# EAGLE design LED_chaser (EAGLE 9.4.2)

## Sheet 1 of 3
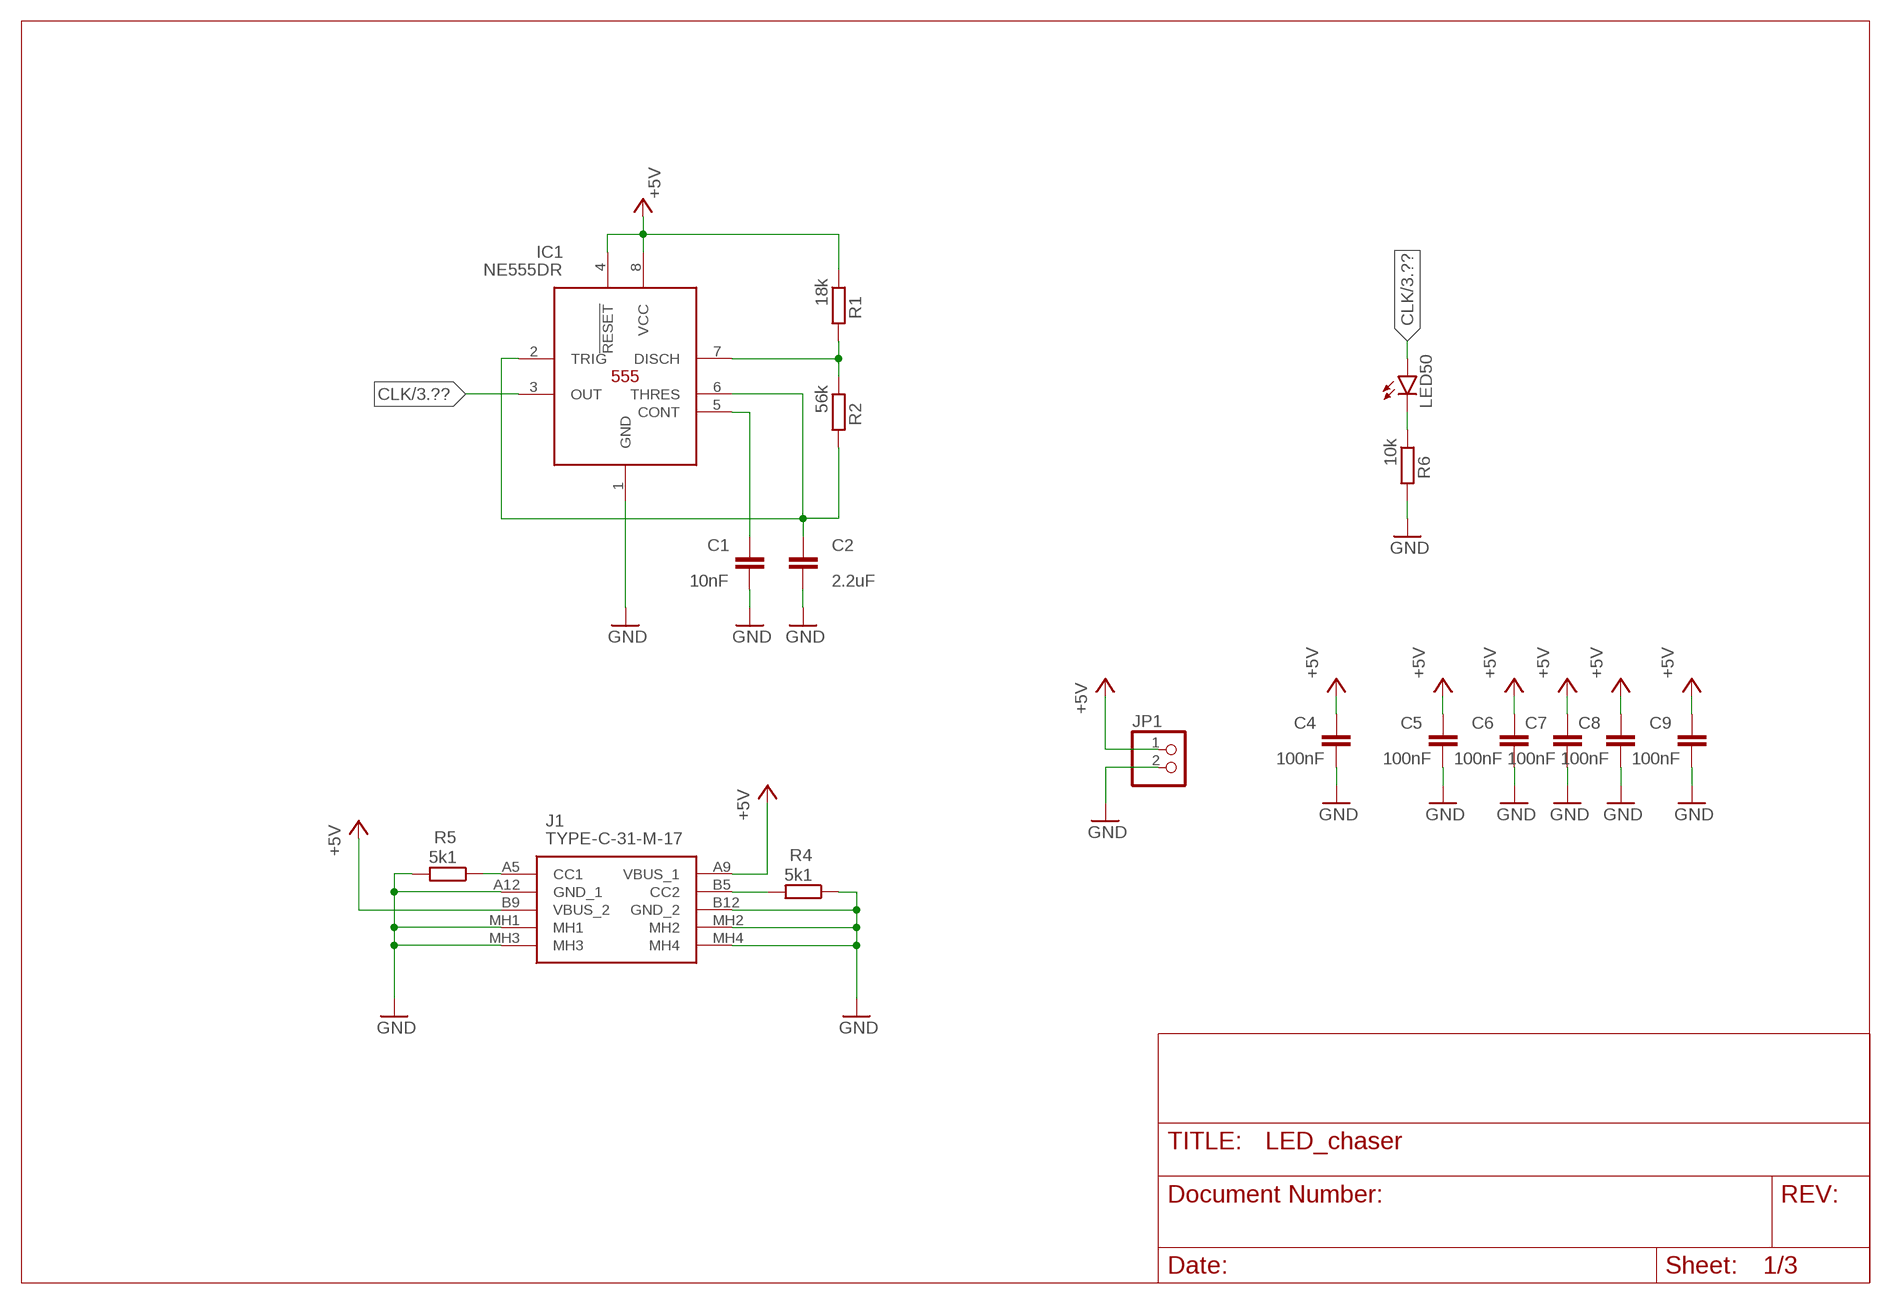
[diagram p0: schematic, sheet 1]

### Parts
C1  10nF  C-EUC0603  [C0603]
C2  2.2uF  C-EUC0603  [C0603]
C4  100nF  C-EUC0603  [C0603]
C5  100nF  C-EUC0603  [C0603]
C6  100nF  C-EUC0603  [C0603]
C7  100nF  C-EUC0603  [C0603]
C8  100nF  C-EUC0603  [C0603]
C9  100nF  C-EUC0603  [C0603]
IC1  NE555DR  [SOIC127P600X175-8N]
J1  TYPE-C-31-M-17  [TYPEC31M17]
JP1  PINHD-1X2  [1X02]
LED50  LEDCHIP-LED0603  [CHIP-LED0603]
R1  18k  R-EU_R0603  [R0603]
R2  56k  R-EU_R0603  [R0603]
R4  5k1  R-EU_R0603  [R0603]
R5  5k1  R-EU_R0603  [R0603]
R6  10k  R-EU_R0603  [R0603]

### Nets
+5V: C4.1 C5.1 C6.1 C7.1 C8.1 C9.1 IC1.4(!RESET) IC1.8(VCC) J1.A9(VBUS_1) J1.B9(VBUS_2) JP1.1 R1.1 ; also sheet 3
CLK: IC1.3(OUT) LED50.A ; also sheet 3
GND: C1.2 C2.2 C4.2 C5.2 C6.2 C7.2 C8.2 C9.2 IC1.1(GND) J1.A12(GND_1) J1.B12(GND_2) J1.MH1 J1.MH2 J1.MH3 J1.MH4 JP1.2 R4.1 R5.2 R6.2 ; also sheet 2,3
N$2: LED50.C R6.1
N$3: IC1.7(DISCH) R1.2 R2.1
N$5: C1.1 IC1.5(CONT)
N$8: C2.1 IC1.2(TRIG) IC1.6(THRES) R2.2
N$46: J1.A5(CC1) R5.1
N$47: J1.B5(CC2) R4.2

## Sheet 2 of 3
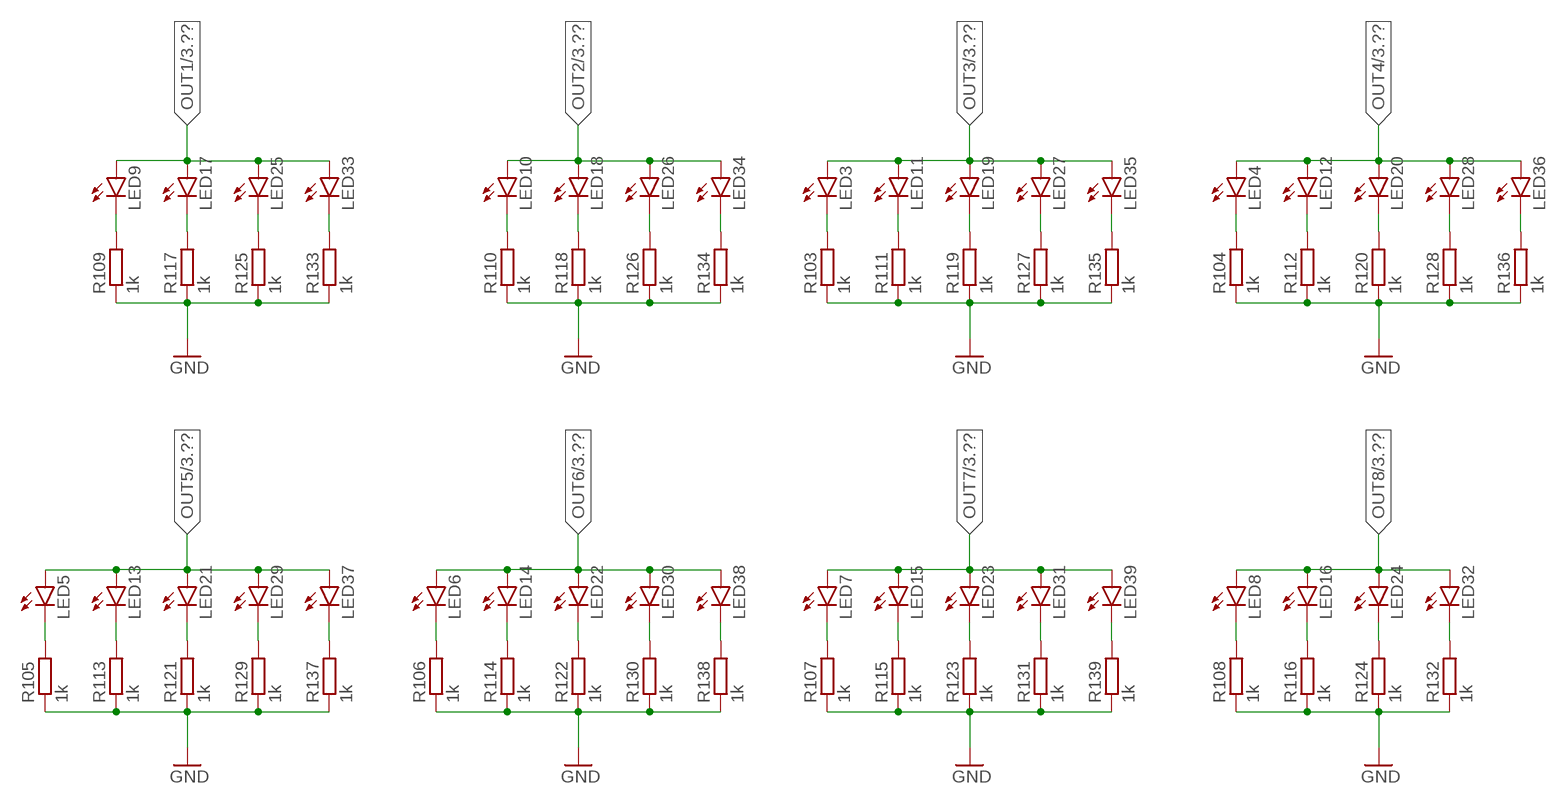
[diagram p1: schematic, sheet 2]

### Parts
LED3  LEDCHIPLED_1206  [CHIPLED_1206]
LED4  LEDCHIPLED_1206  [CHIPLED_1206]
LED5  LEDCHIPLED_1206  [CHIPLED_1206]
LED6  LEDCHIPLED_1206  [CHIPLED_1206]
LED7  LEDCHIPLED_1206  [CHIPLED_1206]
LED8  LEDCHIPLED_1206  [CHIPLED_1206]
LED9  LEDCHIPLED_1206  [CHIPLED_1206]
LED10  LEDCHIPLED_1206  [CHIPLED_1206]
LED11  LEDCHIPLED_1206  [CHIPLED_1206]
LED12  LEDCHIPLED_1206  [CHIPLED_1206]
LED13  LEDCHIPLED_1206  [CHIPLED_1206]
LED14  LEDCHIPLED_1206  [CHIPLED_1206]
LED15  LEDCHIPLED_1206  [CHIPLED_1206]
LED16  LEDCHIPLED_1206  [CHIPLED_1206]
LED17  LEDCHIPLED_1206  [CHIPLED_1206]
LED18  LEDCHIPLED_1206  [CHIPLED_1206]
LED19  LEDCHIPLED_1206  [CHIPLED_1206]
LED20  LEDCHIPLED_1206  [CHIPLED_1206]
LED21  LEDCHIPLED_1206  [CHIPLED_1206]
LED22  LEDCHIPLED_1206  [CHIPLED_1206]
LED23  LEDCHIPLED_1206  [CHIPLED_1206]
LED24  LEDCHIPLED_1206  [CHIPLED_1206]
LED25  LEDCHIPLED_1206  [CHIPLED_1206]
LED26  LEDCHIPLED_1206  [CHIPLED_1206]
LED27  LEDCHIPLED_1206  [CHIPLED_1206]
LED28  LEDCHIPLED_1206  [CHIPLED_1206]
LED29  LEDCHIPLED_1206  [CHIPLED_1206]
LED30  LEDCHIPLED_1206  [CHIPLED_1206]
LED31  LEDCHIPLED_1206  [CHIPLED_1206]
LED32  LEDCHIPLED_1206  [CHIPLED_1206]
LED33  LEDCHIPLED_1206  [CHIPLED_1206]
LED34  LEDCHIPLED_1206  [CHIPLED_1206]
LED35  LEDCHIPLED_1206  [CHIPLED_1206]
LED36  LEDCHIPLED_1206  [CHIPLED_1206]
LED37  LEDCHIPLED_1206  [CHIPLED_1206]
LED38  LEDCHIPLED_1206  [CHIPLED_1206]
LED39  LEDCHIPLED_1206  [CHIPLED_1206]
R103  1k  R-EU_R0603  [R0603]
R104  1k  R-EU_R0603  [R0603]
R105  1k  R-EU_R0603  [R0603]
R106  1k  R-EU_R0603  [R0603]
R107  1k  R-EU_R0603  [R0603]
R108  1k  R-EU_R0603  [R0603]
R109  1k  R-EU_R0603  [R0603]
R110  1k  R-EU_R0603  [R0603]
R111  1k  R-EU_R0603  [R0603]
R112  1k  R-EU_R0603  [R0603]
R113  1k  R-EU_R0603  [R0603]
R114  1k  R-EU_R0603  [R0603]
R115  1k  R-EU_R0603  [R0603]
R116  1k  R-EU_R0603  [R0603]
R117  1k  R-EU_R0603  [R0603]
R118  1k  R-EU_R0603  [R0603]
R119  1k  R-EU_R0603  [R0603]
R120  1k  R-EU_R0603  [R0603]
R121  1k  R-EU_R0603  [R0603]
R122  1k  R-EU_R0603  [R0603]
R123  1k  R-EU_R0603  [R0603]
R124  1k  R-EU_R0603  [R0603]
R125  1k  R-EU_R0603  [R0603]
R126  1k  R-EU_R0603  [R0603]
R127  1k  R-EU_R0603  [R0603]
R128  1k  R-EU_R0603  [R0603]
R129  1k  R-EU_R0603  [R0603]
R130  1k  R-EU_R0603  [R0603]
R131  1k  R-EU_R0603  [R0603]
R132  1k  R-EU_R0603  [R0603]
R133  1k  R-EU_R0603  [R0603]
R134  1k  R-EU_R0603  [R0603]
R135  1k  R-EU_R0603  [R0603]
R136  1k  R-EU_R0603  [R0603]
R137  1k  R-EU_R0603  [R0603]
R138  1k  R-EU_R0603  [R0603]
R139  1k  R-EU_R0603  [R0603]

### Nets
GND: R103.1 R104.1 R105.1 R106.1 R107.1 R108.1 R109.1 R110.1 R111.1 R112.1 R113.1 R114.1 R115.1 R116.1 R117.1 R118.1 R119.1 R120.1 R121.1 R122.1 R123.1 R124.1 R125.1 R126.1 R127.1 R128.1 R129.1 R130.1 R131.1 R132.1 R133.1 R134.1 R135.1 R136.1 R137.1 R138.1 R139.1 ; also sheet 1,3
N$4: LED9.C R109.2
N$7: LED17.C R117.2
N$9: LED25.C R125.2
N$11: LED33.C R133.2
N$13: LED6.C R106.2
N$16: LED14.C R114.2
N$17: LED22.C R122.2
N$18: LED30.C R130.2
N$21: LED38.C R138.2
N$22: LED7.C R107.2
N$23: LED15.C R115.2
N$24: LED23.C R123.2
N$25: LED31.C R131.2
N$26: LED39.C R139.2
N$27: LED5.C R105.2
N$28: LED13.C R113.2
N$29: LED21.C R121.2
N$30: LED29.C R129.2
N$31: LED37.C R137.2
N$32: LED8.C R108.2
N$33: LED16.C R116.2
N$34: LED24.C R124.2
N$35: LED32.C R132.2
N$38: LED10.C R110.2
N$39: LED18.C R118.2
N$40: LED26.C R126.2
N$41: LED34.C R134.2
N$42: LED3.C R103.2
N$43: LED11.C R111.2
N$44: LED19.C R119.2
N$45: LED27.C R127.2
N$51: LED35.C R135.2
N$52: LED4.C R104.2
N$53: LED12.C R112.2
N$54: LED20.C R120.2
N$55: LED28.C R128.2
N$56: LED36.C R136.2
OUT1: LED9.A LED17.A LED25.A LED33.A ; also sheet 3
OUT2: LED10.A LED18.A LED26.A LED34.A ; also sheet 3
OUT3: LED3.A LED11.A LED19.A LED27.A LED35.A ; also sheet 3
OUT4: LED4.A LED12.A LED20.A LED28.A LED36.A ; also sheet 3
OUT5: LED5.A LED13.A LED21.A LED29.A LED37.A ; also sheet 3
OUT6: LED6.A LED14.A LED22.A LED30.A LED38.A ; also sheet 3
OUT7: LED7.A LED15.A LED23.A LED31.A LED39.A ; also sheet 3
OUT8: LED8.A LED16.A LED24.A LED32.A ; also sheet 3

## Sheet 3 of 3
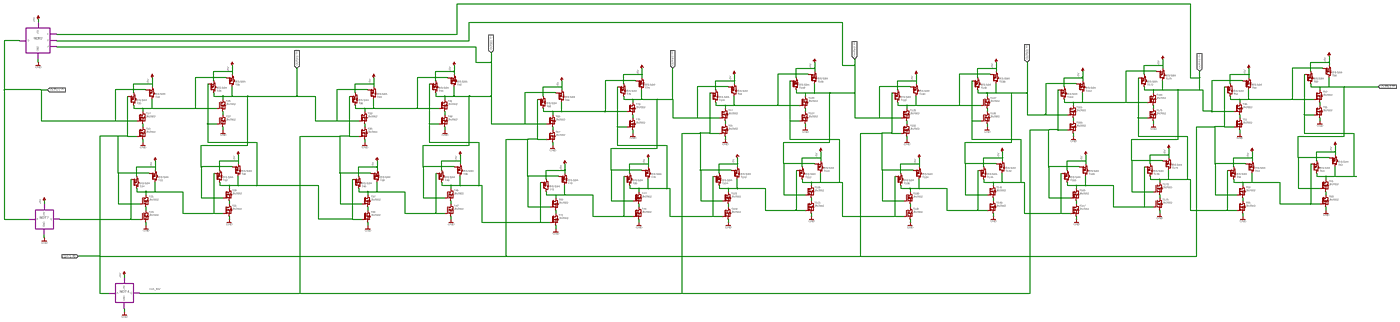
[diagram p2: schematic, sheet 3, overview]
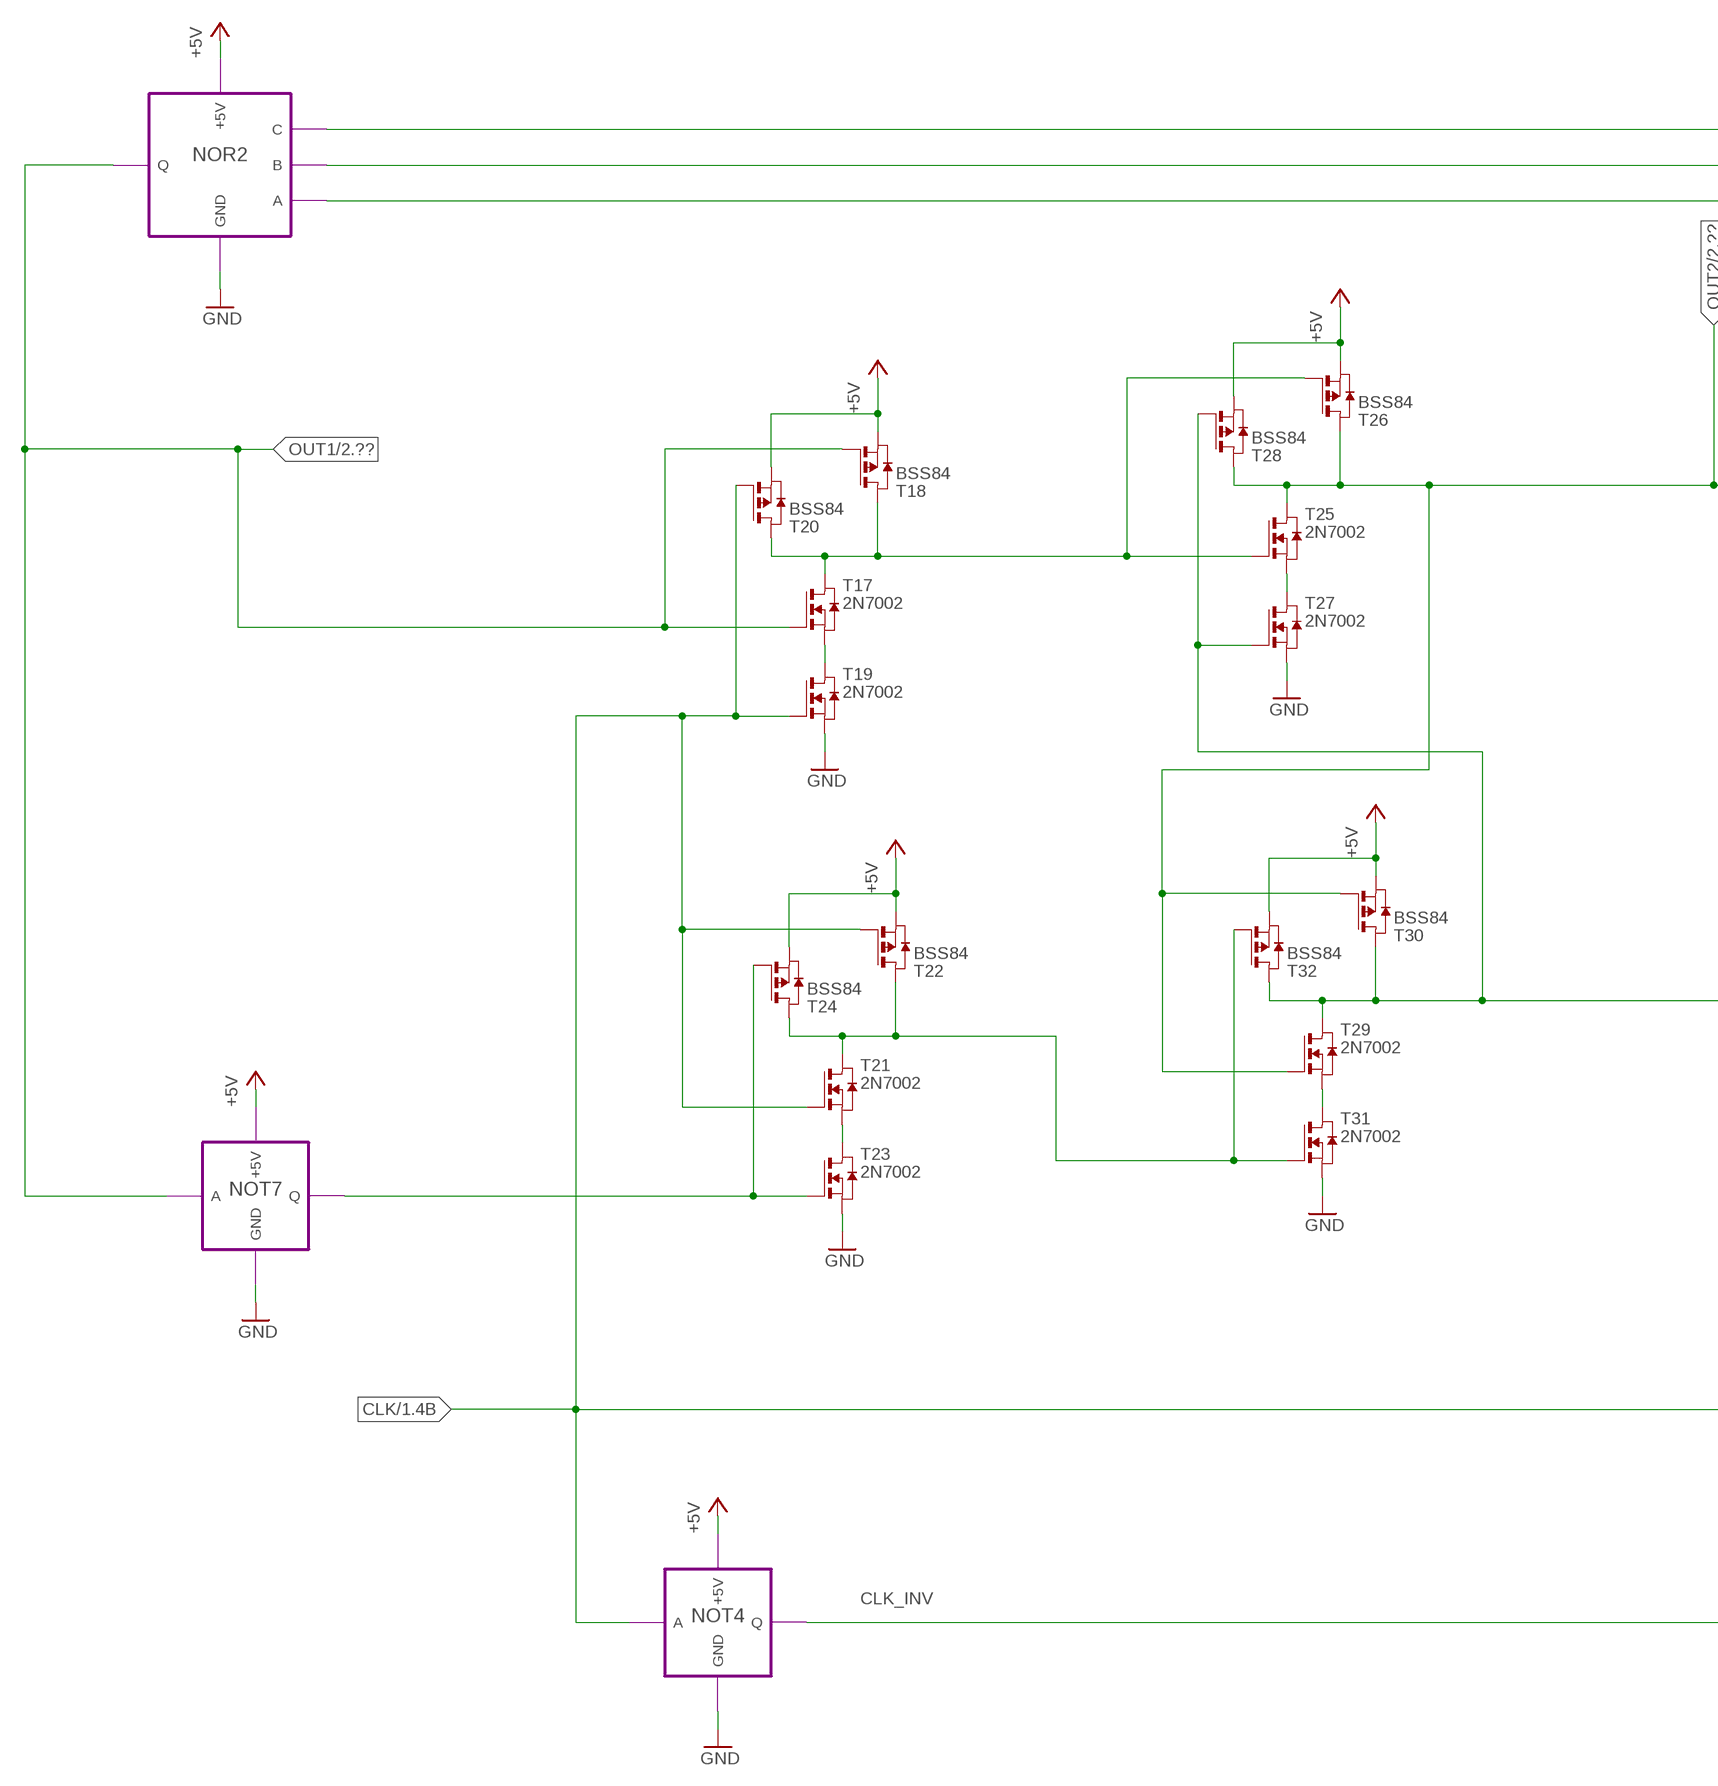
[diagram p3: schematic, sheet 3, part 1 of 4]
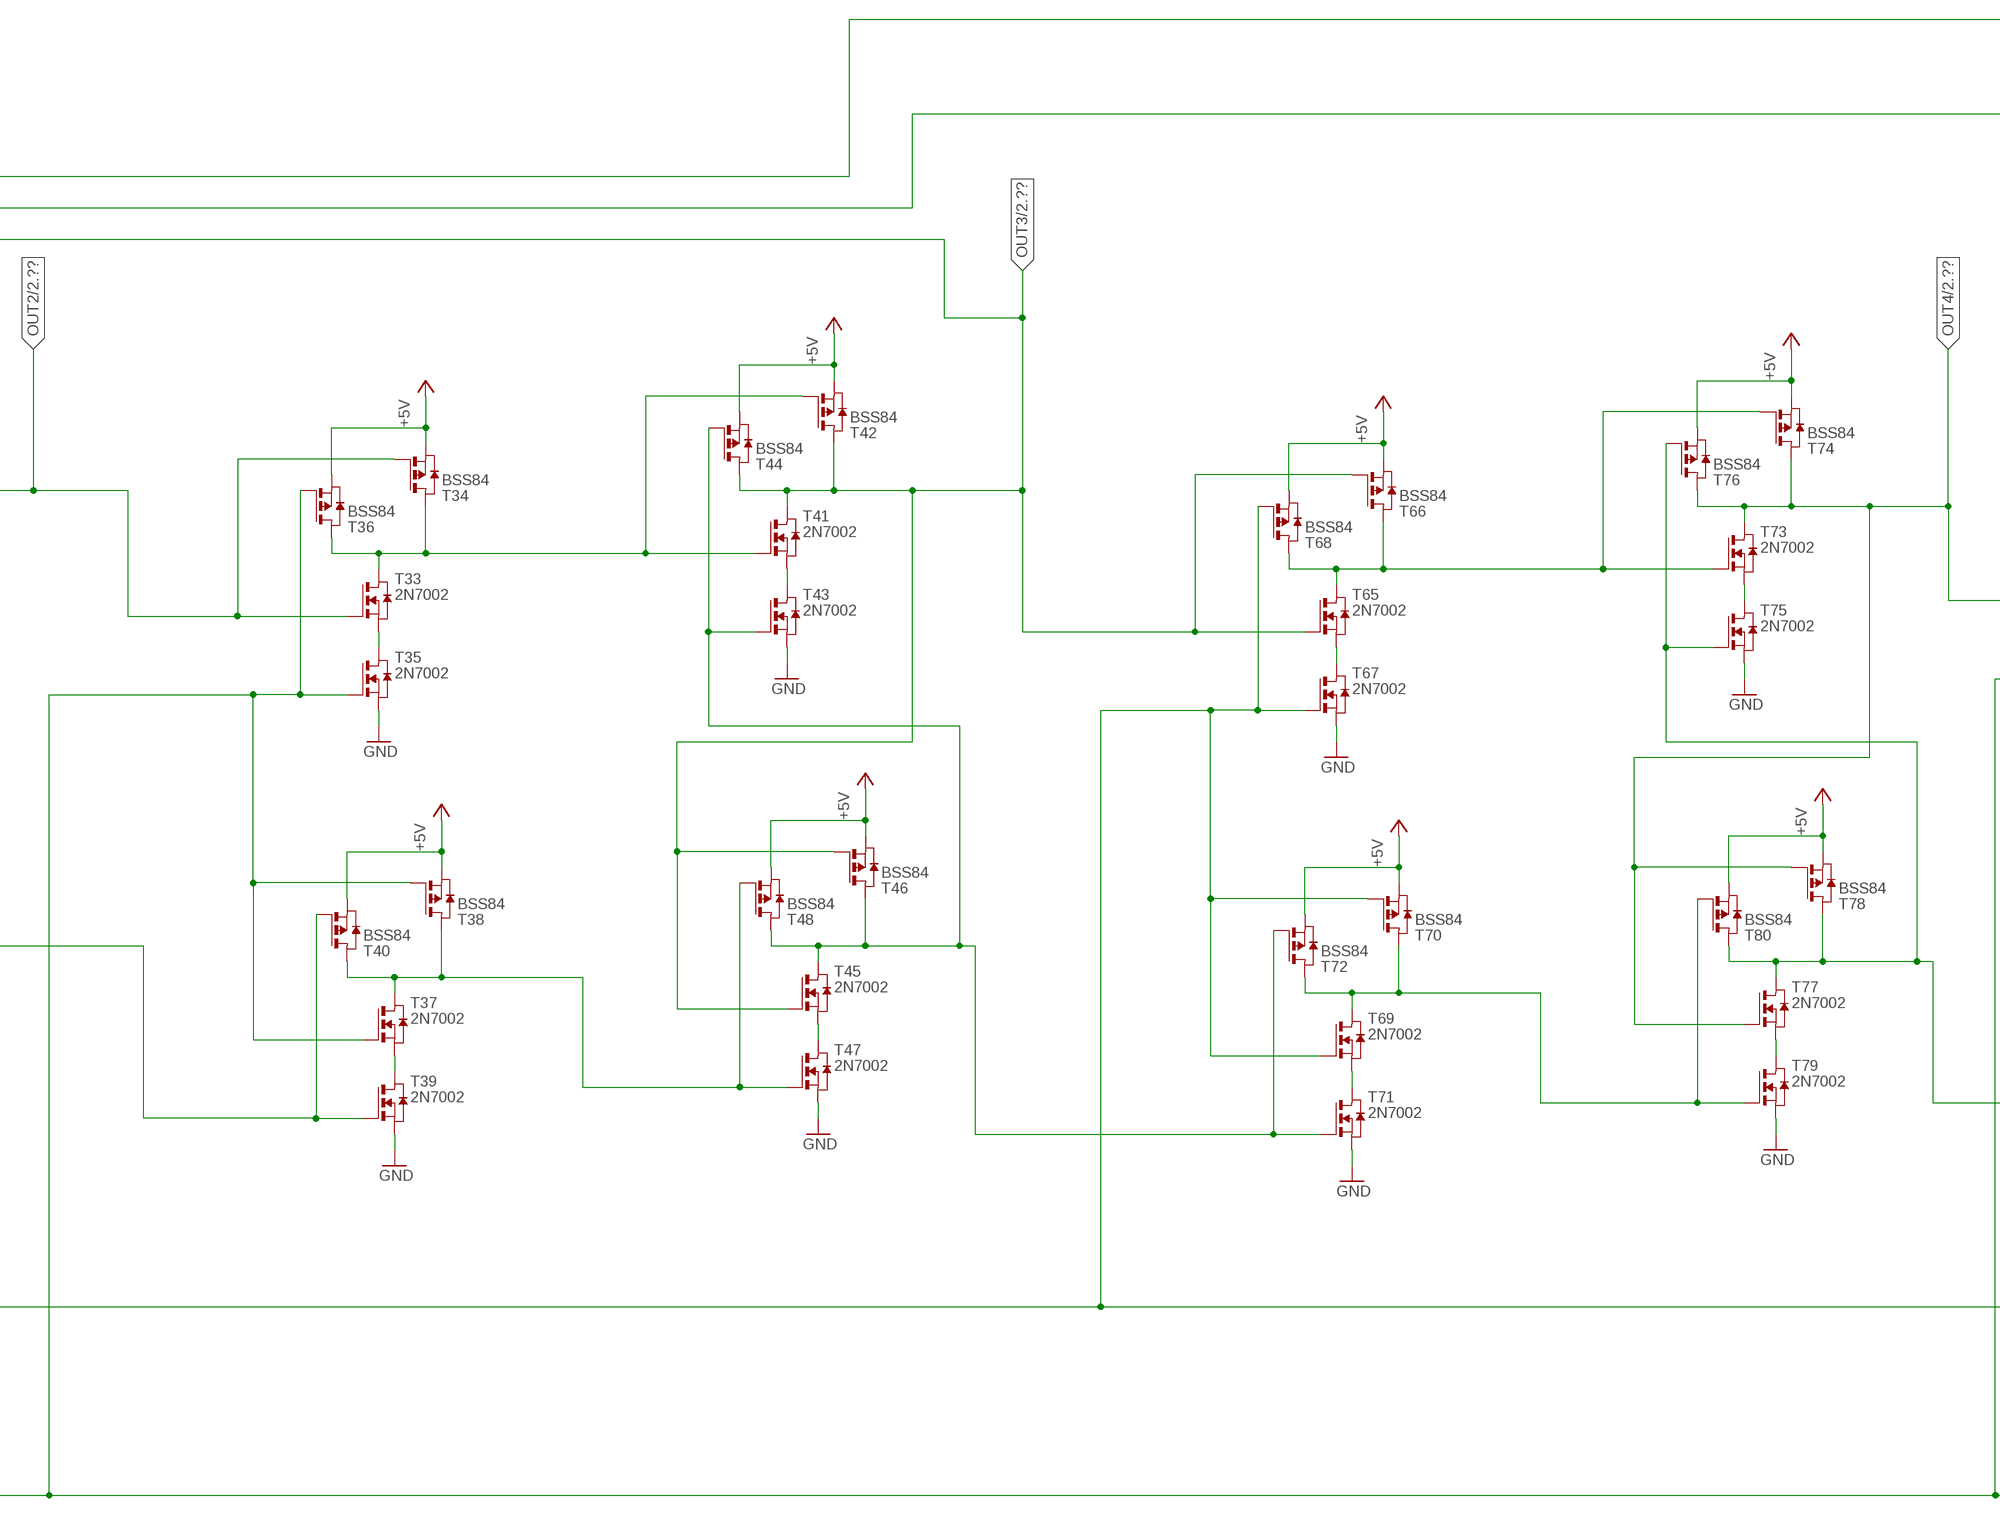
[diagram p4: schematic, sheet 3, part 2 of 4]
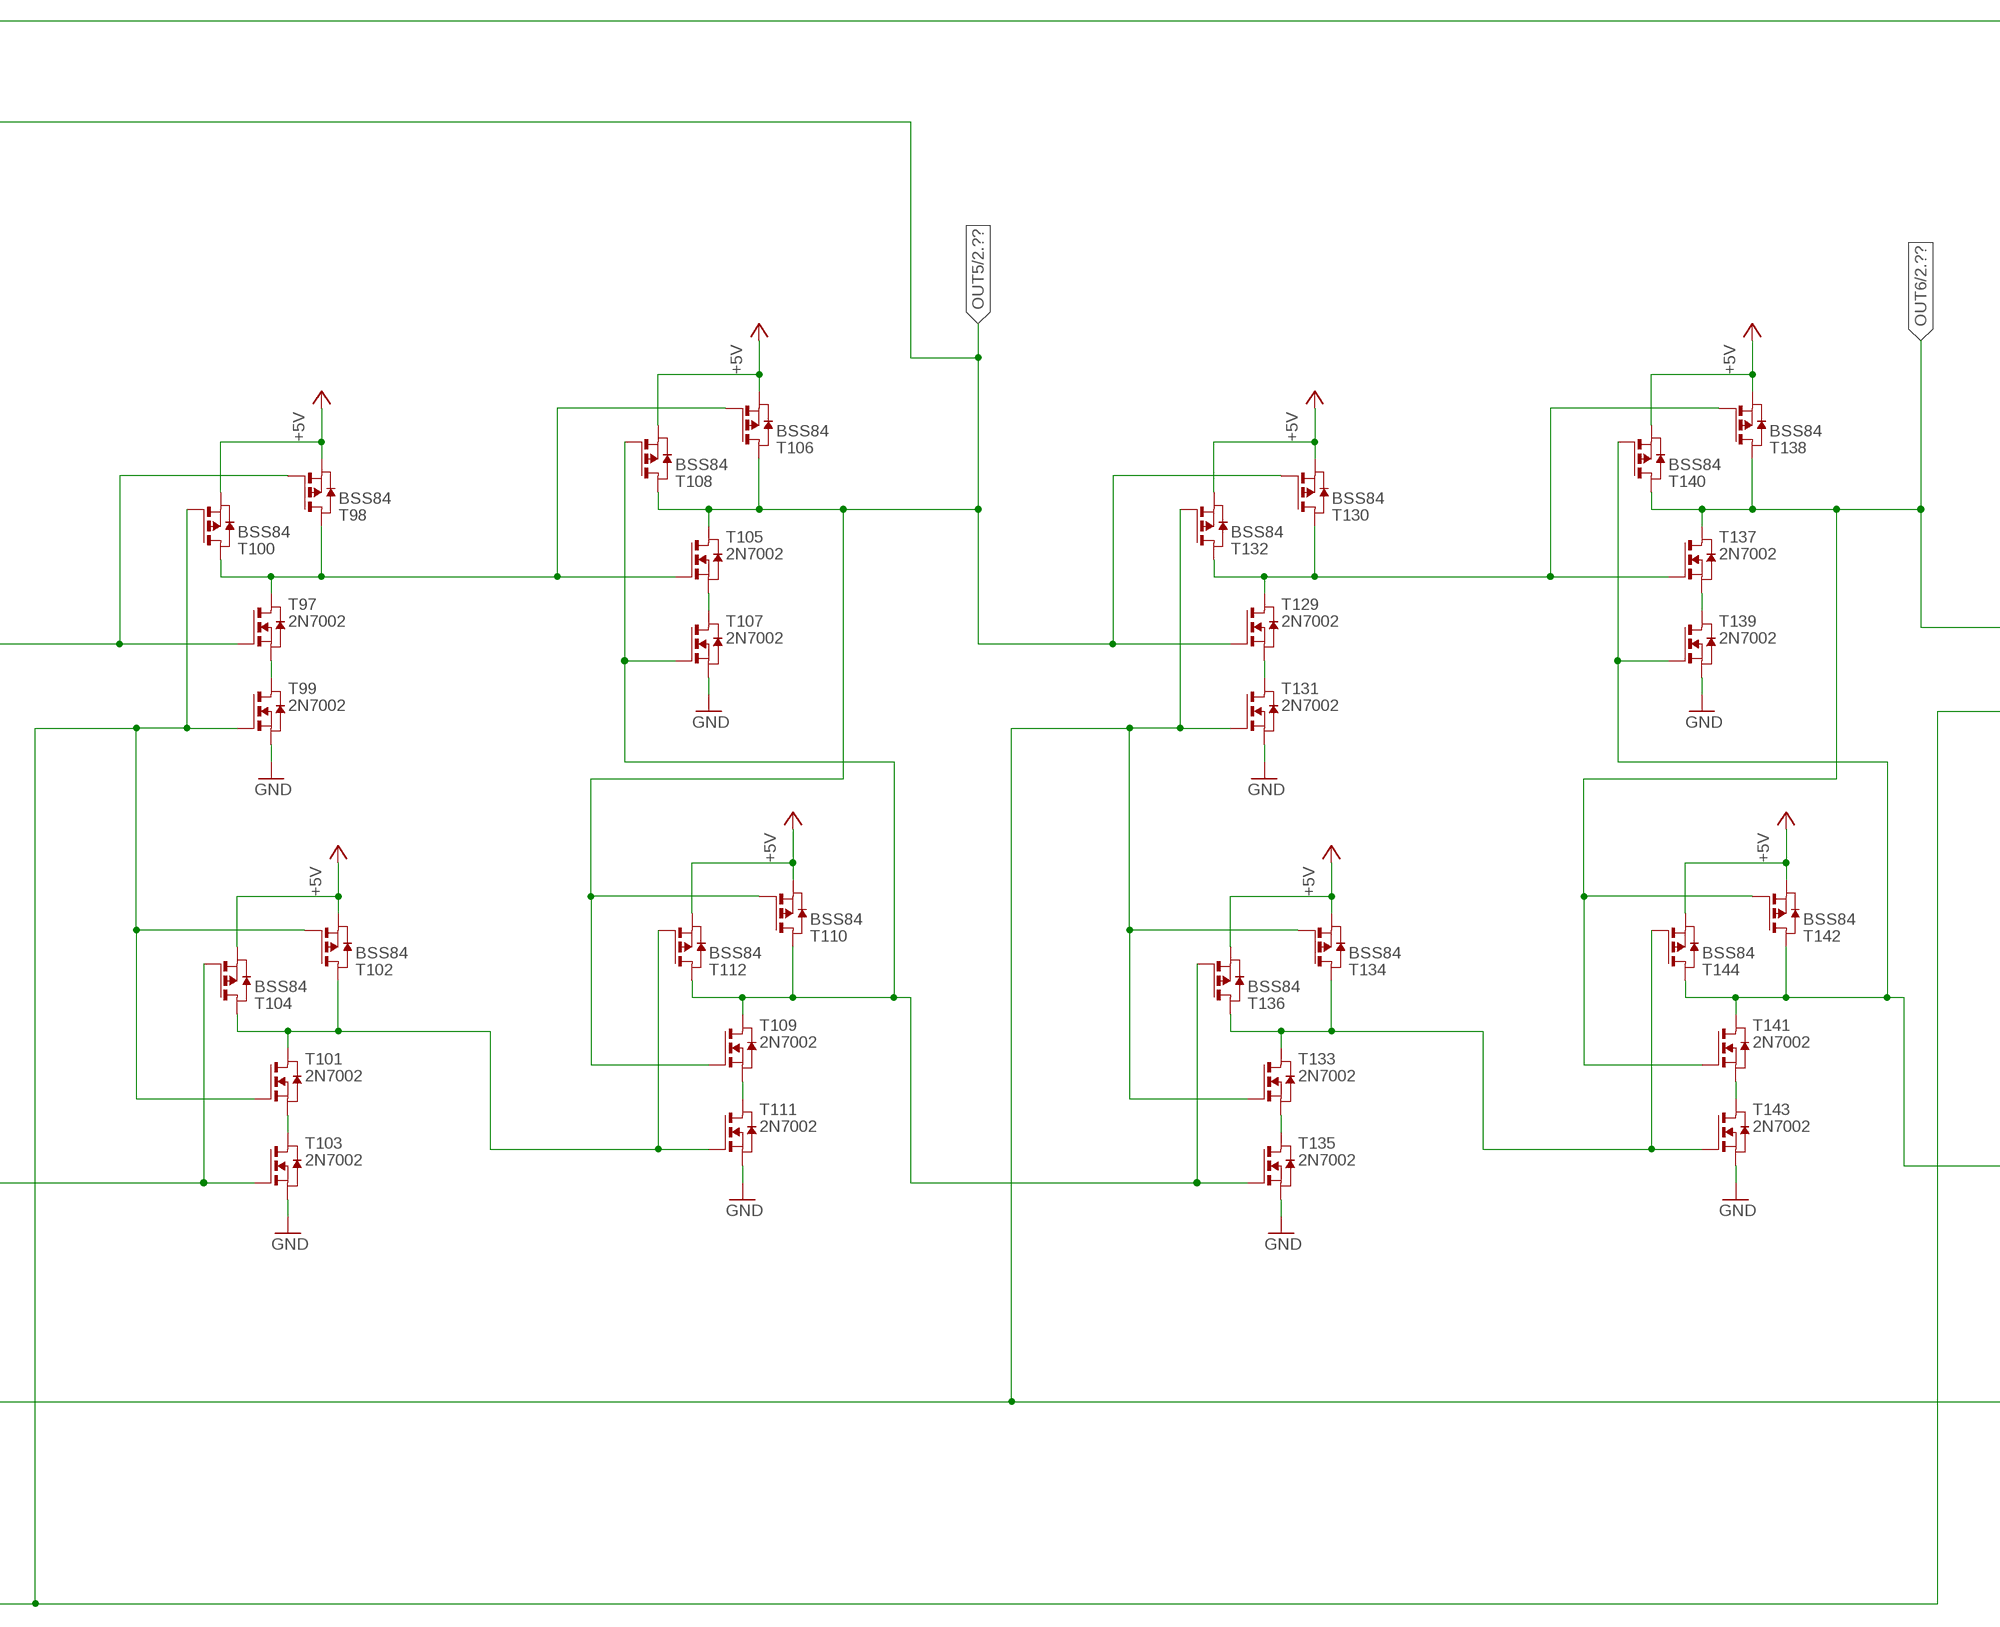
[diagram p5: schematic, sheet 3, part 3 of 4]
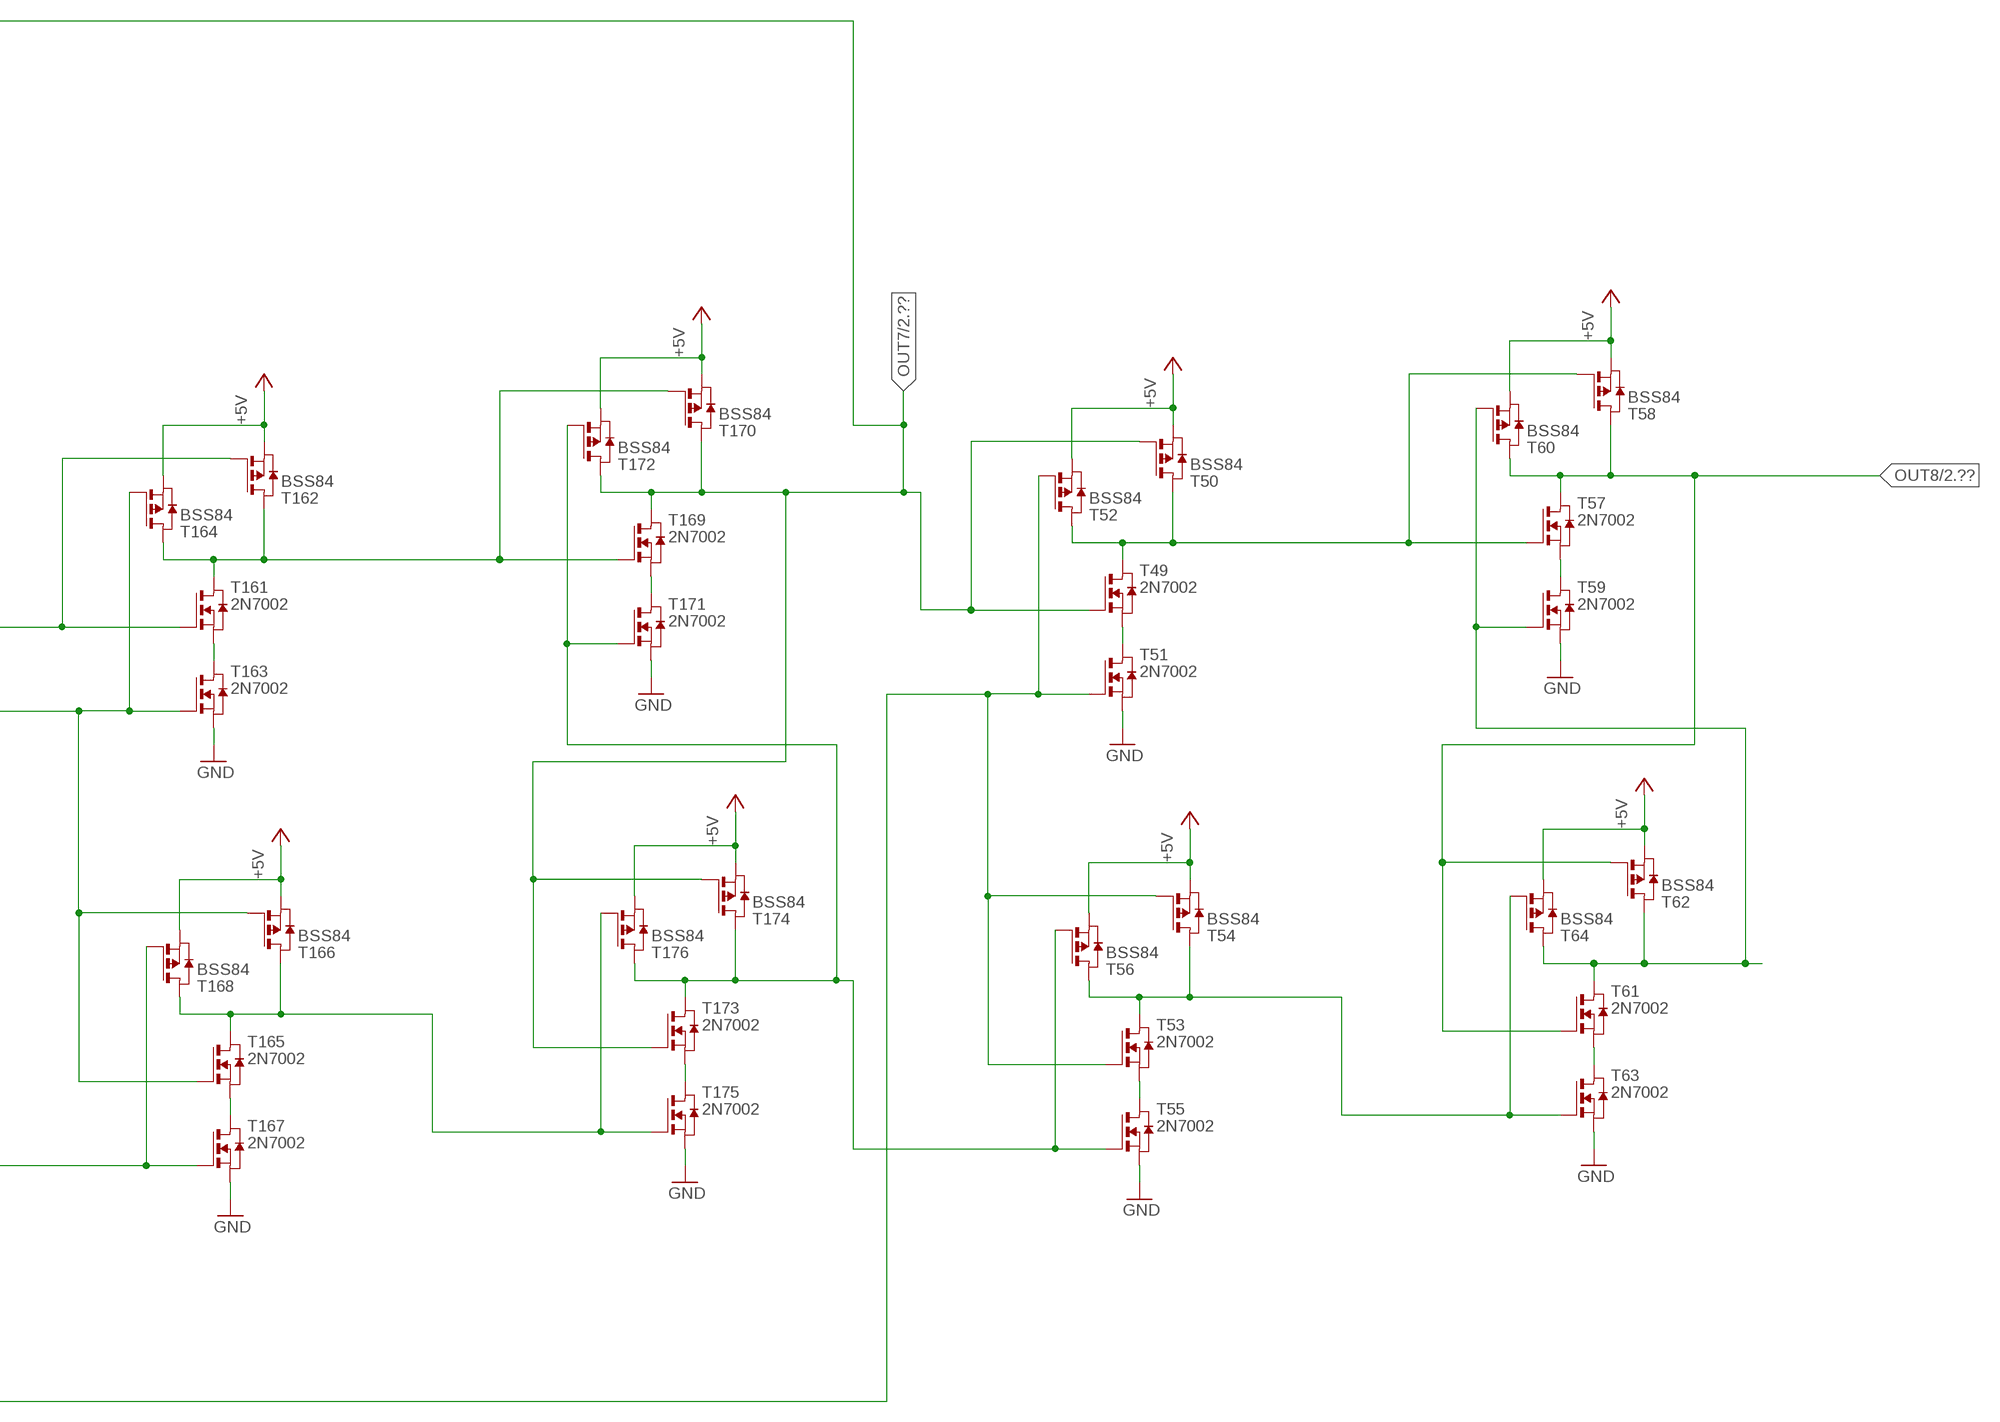
[diagram p6: schematic, sheet 3, part 4 of 4]

### Parts
T17  2N7002  NMOSSOT23  [SOT-23]
T18  BSS84  PMOSSOT23  [SOT-23]
T19  2N7002  NMOSSOT23  [SOT-23]
T20  BSS84  PMOSSOT23  [SOT-23]
T21  2N7002  NMOSSOT23  [SOT-23]
T22  BSS84  PMOSSOT23  [SOT-23]
T23  2N7002  NMOSSOT23  [SOT-23]
T24  BSS84  PMOSSOT23  [SOT-23]
T25  2N7002  NMOSSOT23  [SOT-23]
T26  BSS84  PMOSSOT23  [SOT-23]
T27  2N7002  NMOSSOT23  [SOT-23]
T28  BSS84  PMOSSOT23  [SOT-23]
T29  2N7002  NMOSSOT23  [SOT-23]
T30  BSS84  PMOSSOT23  [SOT-23]
T31  2N7002  NMOSSOT23  [SOT-23]
T32  BSS84  PMOSSOT23  [SOT-23]
T33  2N7002  NMOSSOT23  [SOT-23]
T34  BSS84  PMOSSOT23  [SOT-23]
T35  2N7002  NMOSSOT23  [SOT-23]
T36  BSS84  PMOSSOT23  [SOT-23]
T37  2N7002  NMOSSOT23  [SOT-23]
T38  BSS84  PMOSSOT23  [SOT-23]
T39  2N7002  NMOSSOT23  [SOT-23]
T40  BSS84  PMOSSOT23  [SOT-23]
T41  2N7002  NMOSSOT23  [SOT-23]
T42  BSS84  PMOSSOT23  [SOT-23]
T43  2N7002  NMOSSOT23  [SOT-23]
T44  BSS84  PMOSSOT23  [SOT-23]
T45  2N7002  NMOSSOT23  [SOT-23]
T46  BSS84  PMOSSOT23  [SOT-23]
T47  2N7002  NMOSSOT23  [SOT-23]
T48  BSS84  PMOSSOT23  [SOT-23]
T49  2N7002  NMOSSOT23  [SOT-23]
T50  BSS84  PMOSSOT23  [SOT-23]
T51  2N7002  NMOSSOT23  [SOT-23]
T52  BSS84  PMOSSOT23  [SOT-23]
T53  2N7002  NMOSSOT23  [SOT-23]
T54  BSS84  PMOSSOT23  [SOT-23]
T55  2N7002  NMOSSOT23  [SOT-23]
T56  BSS84  PMOSSOT23  [SOT-23]
T57  2N7002  NMOSSOT23  [SOT-23]
T58  BSS84  PMOSSOT23  [SOT-23]
T59  2N7002  NMOSSOT23  [SOT-23]
T60  BSS84  PMOSSOT23  [SOT-23]
T61  2N7002  NMOSSOT23  [SOT-23]
T62  BSS84  PMOSSOT23  [SOT-23]
T63  2N7002  NMOSSOT23  [SOT-23]
T64  BSS84  PMOSSOT23  [SOT-23]
T65  2N7002  NMOSSOT23  [SOT-23]
T66  BSS84  PMOSSOT23  [SOT-23]
T67  2N7002  NMOSSOT23  [SOT-23]
T68  BSS84  PMOSSOT23  [SOT-23]
T69  2N7002  NMOSSOT23  [SOT-23]
T70  BSS84  PMOSSOT23  [SOT-23]
T71  2N7002  NMOSSOT23  [SOT-23]
T72  BSS84  PMOSSOT23  [SOT-23]
T73  2N7002  NMOSSOT23  [SOT-23]
T74  BSS84  PMOSSOT23  [SOT-23]
T75  2N7002  NMOSSOT23  [SOT-23]
T76  BSS84  PMOSSOT23  [SOT-23]
T77  2N7002  NMOSSOT23  [SOT-23]
T78  BSS84  PMOSSOT23  [SOT-23]
T79  2N7002  NMOSSOT23  [SOT-23]
T80  BSS84  PMOSSOT23  [SOT-23]
T97  2N7002  NMOSSOT23  [SOT-23]
T98  BSS84  PMOSSOT23  [SOT-23]
T99  2N7002  NMOSSOT23  [SOT-23]
T100  BSS84  PMOSSOT23  [SOT-23]
T101  2N7002  NMOSSOT23  [SOT-23]
T102  BSS84  PMOSSOT23  [SOT-23]
T103  2N7002  NMOSSOT23  [SOT-23]
T104  BSS84  PMOSSOT23  [SOT-23]
T105  2N7002  NMOSSOT23  [SOT-23]
T106  BSS84  PMOSSOT23  [SOT-23]
T107  2N7002  NMOSSOT23  [SOT-23]
T108  BSS84  PMOSSOT23  [SOT-23]
T109  2N7002  NMOSSOT23  [SOT-23]
T110  BSS84  PMOSSOT23  [SOT-23]
T111  2N7002  NMOSSOT23  [SOT-23]
T112  BSS84  PMOSSOT23  [SOT-23]
T129  2N7002  NMOSSOT23  [SOT-23]
T130  BSS84  PMOSSOT23  [SOT-23]
T131  2N7002  NMOSSOT23  [SOT-23]
T132  BSS84  PMOSSOT23  [SOT-23]
T133  2N7002  NMOSSOT23  [SOT-23]
T134  BSS84  PMOSSOT23  [SOT-23]
T135  2N7002  NMOSSOT23  [SOT-23]
T136  BSS84  PMOSSOT23  [SOT-23]
T137  2N7002  NMOSSOT23  [SOT-23]
T138  BSS84  PMOSSOT23  [SOT-23]
T139  2N7002  NMOSSOT23  [SOT-23]
T140  BSS84  PMOSSOT23  [SOT-23]
T141  2N7002  NMOSSOT23  [SOT-23]
T142  BSS84  PMOSSOT23  [SOT-23]
T143  2N7002  NMOSSOT23  [SOT-23]
T144  BSS84  PMOSSOT23  [SOT-23]
T161  2N7002  NMOSSOT23  [SOT-23]
T162  BSS84  PMOSSOT23  [SOT-23]
T163  2N7002  NMOSSOT23  [SOT-23]
T164  BSS84  PMOSSOT23  [SOT-23]
T165  2N7002  NMOSSOT23  [SOT-23]
T166  BSS84  PMOSSOT23  [SOT-23]
T167  2N7002  NMOSSOT23  [SOT-23]
T168  BSS84  PMOSSOT23  [SOT-23]
T169  2N7002  NMOSSOT23  [SOT-23]
T170  BSS84  PMOSSOT23  [SOT-23]
T171  2N7002  NMOSSOT23  [SOT-23]
T172  BSS84  PMOSSOT23  [SOT-23]
T173  2N7002  NMOSSOT23  [SOT-23]
T174  BSS84  PMOSSOT23  [SOT-23]
T175  2N7002  NMOSSOT23  [SOT-23]
T176  BSS84  PMOSSOT23  [SOT-23]

### Module instances
NOT4 = NOT
NOT7 = NOT
NOR2 = NOR_3IN

### Nets
+5V: T18.2(S) T20.2(S) T22.2(S) T24.2(S) T26.2(S) T28.2(S) T30.2(S) T32.2(S) T34.2(S) T36.2(S) T38.2(S) T40.2(S) T42.2(S) T44.2(S) T46.2(S) T48.2(S) T50.2(S) T52.2(S) T54.2(S) T56.2(S) T58.2(S) T60.2(S) T62.2(S) T64.2(S) T66.2(S) T68.2(S) T70.2(S) T72.2(S) T74.2(S) T76.2(S) T78.2(S) T80.2(S) T98.2(S) T100.2(S) T102.2(S) T104.2(S) T106.2(S) T108.2(S) T110.2(S) T112.2(S) T130.2(S) T132.2(S) T134.2(S) T136.2(S) T138.2(S) T140.2(S) T142.2(S) T144.2(S) T162.2(S) T164.2(S) T166.2(S) T168.2(S) T170.2(S) T172.2(S) T174.2(S) T176.2(S) ; port NOT4.+5V NOR2.+5V NOT7.+5V ; also sheet 1
CLK: T19.3(G) T20.3(G) T21.3(G) T22.3(G) T51.3(G) T52.3(G) T53.3(G) T54.3(G) T67.3(G) T68.3(G) T69.3(G) T70.3(G) T131.3(G) T132.3(G) T133.3(G) T134.3(G) ; port NOT4.A ; also sheet 1
CLK_INV: T35.3(G) T36.3(G) T37.3(G) T38.3(G) T99.3(G) T100.3(G) T101.3(G) T102.3(G) T163.3(G) T164.3(G) T165.3(G) T166.3(G) ; port NOT4.Q
GND: T19.2(S) T23.2(S) T27.2(S) T31.2(S) T35.2(S) T39.2(S) T43.2(S) T47.2(S) T51.2(S) T55.2(S) T59.2(S) T63.2(S) T67.2(S) T71.2(S) T75.2(S) T79.2(S) T99.2(S) T103.2(S) T107.2(S) T111.2(S) T131.2(S) T135.2(S) T139.2(S) T143.2(S) T163.2(S) T167.2(S) T171.2(S) T175.2(S) ; port NOT4.GND NOR2.GND NOT7.GND ; also sheet 1,2
N$1: T23.3(G) T24.3(G) ; port NOT7.Q
N$68: T27.3(G) T28.3(G) T29.1(D) T30.1(D) T32.1(D) T39.3(G) T40.3(G)
N$69: T17.2(S) T19.1(D)
N$70: T21.2(S) T23.1(D)
N$71: T25.2(S) T27.1(D)
N$72: T29.2(S) T31.1(D)
N$73: T17.1(D) T18.1(D) T20.1(D) T25.3(G) T26.3(G)
N$74: T21.1(D) T22.1(D) T24.1(D) T31.3(G) T32.3(G)
N$79: T43.3(G) T44.3(G) T45.1(D) T46.1(D) T48.1(D) T71.3(G) T72.3(G)
N$80: T33.2(S) T35.1(D)
N$81: T37.2(S) T39.1(D)
N$82: T41.2(S) T43.1(D)
N$83: T45.2(S) T47.1(D)
N$84: T33.1(D) T34.1(D) T36.1(D) T41.3(G) T42.3(G)
N$85: T37.1(D) T38.1(D) T40.1(D) T47.3(G) T48.3(G)
N$90: T59.3(G) T60.3(G) T61.1(D) T62.1(D) T64.1(D)
N$91: T49.2(S) T51.1(D)
N$92: T53.2(S) T55.1(D)
N$93: T57.2(S) T59.1(D)
N$94: T61.2(S) T63.1(D)
N$95: T49.1(D) T50.1(D) T52.1(D) T57.3(G) T58.3(G)
N$96: T53.1(D) T54.1(D) T56.1(D) T63.3(G) T64.3(G)
N$101: T75.3(G) T76.3(G) T77.1(D) T78.1(D) T80.1(D) T103.3(G) T104.3(G)
N$102: T65.2(S) T67.1(D)
N$103: T69.2(S) T71.1(D)
N$104: T73.2(S) T75.1(D)
N$105: T77.2(S) T79.1(D)
N$106: T65.1(D) T66.1(D) T68.1(D) T73.3(G) T74.3(G)
N$107: T69.1(D) T70.1(D) T72.1(D) T79.3(G) T80.3(G)
N$123: T107.3(G) T108.3(G) T109.1(D) T110.1(D) T112.1(D) T135.3(G) T136.3(G)
N$124: T97.2(S) T99.1(D)
N$125: T101.2(S) T103.1(D)
N$126: T105.2(S) T107.1(D)
N$127: T109.2(S) T111.1(D)
N$128: T97.1(D) T98.1(D) T100.1(D) T105.3(G) T106.3(G)
N$129: T101.1(D) T102.1(D) T104.1(D) T111.3(G) T112.3(G)
N$145: T139.3(G) T140.3(G) T141.1(D) T142.1(D) T144.1(D) T167.3(G) T168.3(G)
N$146: T129.2(S) T131.1(D)
N$147: T133.2(S) T135.1(D)
N$148: T137.2(S) T139.1(D)
N$149: T141.2(S) T143.1(D)
N$150: T129.1(D) T130.1(D) T132.1(D) T137.3(G) T138.3(G)
N$151: T133.1(D) T134.1(D) T136.1(D) T143.3(G) T144.3(G)
N$167: T55.3(G) T56.3(G) T171.3(G) T172.3(G) T173.1(D) T174.1(D) T176.1(D)
N$168: T161.2(S) T163.1(D)
N$169: T165.2(S) T167.1(D)
N$170: T169.2(S) T171.1(D)
N$171: T173.2(S) T175.1(D)
N$172: T161.1(D) T162.1(D) T164.1(D) T169.3(G) T170.3(G)
N$173: T165.1(D) T166.1(D) T168.1(D) T175.3(G) T176.3(G)
OUT1: T17.3(G) T18.3(G) ; port NOR2.Q NOT7.A ; also sheet 2
OUT2: T25.1(D) T26.1(D) T28.1(D) T29.3(G) T30.3(G) T33.3(G) T34.3(G) ; also sheet 2
OUT3: T41.1(D) T42.1(D) T44.1(D) T45.3(G) T46.3(G) T65.3(G) T66.3(G) ; port NOR2.A ; also sheet 2
OUT4: T73.1(D) T74.1(D) T76.1(D) T77.3(G) T78.3(G) T97.3(G) T98.3(G) ; also sheet 2
OUT5: T105.1(D) T106.1(D) T108.1(D) T109.3(G) T110.3(G) T129.3(G) T130.3(G) ; port NOR2.B ; also sheet 2
OUT6: T137.1(D) T138.1(D) T140.1(D) T141.3(G) T142.3(G) T161.3(G) T162.3(G) ; also sheet 2
OUT7: T49.3(G) T50.3(G) T169.1(D) T170.1(D) T172.1(D) T173.3(G) T174.3(G) ; port NOR2.C ; also sheet 2
OUT8: T57.1(D) T58.1(D) T60.1(D) T61.3(G) T62.3(G) ; also sheet 2

## Library data of the parts
C1 C2 C4-C9 = rcl:C-EU: CAPACITOR, European symbol; SPICEPREFIX: C
IC1 = NE555DR:NE555DR: Single Precision Timer Source: Datasheet <http://www.ti.com/lit/ds/symlink/ne555.pdf>; DESCRIPTION: Single Precision Timer; HEIGHT: 1.75mm; MANUFACTURER_NAME: Texas Instruments; MANUFACTURER_PART_NUMBER: NE555DR; MOUSER_PART_NUMBER: 595-NE555DR; MOUSER_PRICE-STOCK: https://www.mouser.com/Search/Refine.aspx?Keyword=595-NE555DR; RS_PART_NUMBER: 0526959; RS_PRICE-STOCK: http://uk.rs-online.com/web/p/products/0526959
J1 = TYPE-C-31-M-17:TYPE-C-31-M-17: USB Connectors 6 Receptacle 1 RoHS Source: Datasheet <https://datasheet.lcsc.com/szlcsc/1903211732_Korean-Hroparts-Elec-TYPE-C-31-M-17_C283540.pdf>; DESCRIPTION: USB Connectors 6 Receptacle 1 RoHS; HEIGHT: 3.26mm; MANUFACTURER_NAME: Korean Hroparts Elec; MANUFACTURER_PART_NUMBER: TYPE-C-31-M-17
JP1 = pinhead:PINHD-1X2: PIN HEADER
LED3-LED39 LED50 = led:LED: LED OSRAM: - CHIPLED LG R971, LG N971, LY N971, LG Q971, LY Q971, LO R971, LY R971 LH N974, LH R974 LS Q976, LO Q976, LY Q976 LO Q996 - Hyper CHIPLED LW Q18S LB Q993, LB Q99A, LB R99A - SideLED LS A670, LO A670, LY A670, LG A670, LP A670 LB A673, LV A673, LT A673, LW A673 LH A674 LY A675 LS A676, LA A676, LO A676, LY A676, LW A676 LS A679, LY A679, LG A679 - Hyper Micro SIDELED® LS Y876, LA Y876, LO Y876, LY Y876 LT Y87S - SmartLED LW L88C, LW L88S LB L89C, LB L89S, LG L890 LS L89K, LO L89K, LY L89K LS L896, LA L896, LO L896, LY L896 - TOPLED LS T670, LO T670, LY T670, LG T670, LP T670 LSG T670, LSP T670, LSY T670, LOP T670, LYG T670 LG T671, LOG T671, LSG T671 LB T673, LV T673, LT T673, LW T673 LH T674 LS T676, LA T676, LO T676, LY T676, LB T676, LH T676, LSB T676, LW T676 LB T67C, LV T67C, LT T67C, LS T67K, LO T67K, LY T67K, LW E67C LS E67B, LA E67B, LO E67B, LY E67B, LB E67C, LV E67C, LT E67C LW T67C LS T679, LY T679, LG T679 LS T770, LO T770, LY T770, LG T770, LP T770 LB T773, LV T773, LT T773, LW T773 LH T774 LS E675, LA E675, LY E675, LS T675 LS T776, LA T776, LO T776, LY T776, LB T776 LHGB T686 LT T68C, LB T68C - Hyper Mini TOPLED® LB M676 - Mini TOPLED Santana® LG M470 LS M47K, LO M47K, LY M47K Source: http://www.osram.convergy.de LUXEON: - LUMILED® LXK2-PW12-R00, LXK2-PW12-S00, LXK2-PW14-U00, LXK2-PW14-V00 LXK2-PM12-R00, LXK2-PM12-S00, LXK2-PM14-U00 LXK2-PE12-Q00, LXK2-PE12-R00, LXK2-PE12-S00, LXK2-PE14-T00, LXK2-PE14-U00 LXK2-PB12-K00, LXK2-PB12-L00, LXK2-PB12-M00, LXK2-PB14-N00, LXK2-PB14-P00, LXK2-PB14-Q00 LXK2-PR12-L00, LXK2-PR12-M00, LXK2-PR14-Q00, LXK2-PR14-R00 LXK2-PD12-Q00, LXK2-PD12-R00, LXK2-PD12-S00 LXK2-PH12-R00, LXK2-PH12-S00 LXK2-PL12-P00, LXK2-PL12-Q00, LXK2-PL12-R00 Source: www.luxeon.com KINGBRIGHT: KA-3528ASYC Source: www.kingbright.com
R1 R2 R4-R6 R103-R139 = rcl:R-EU_: RESISTOR, European symbol; SPICEPREFIX: R
T17 T19 T21 T23 T25 T27 T29 T31 T33 T35 T37 T39 T41 T43 T45 T47 T49 T51 T53 T55 T57 T59 T61 T63 T65 T67 T69 T71 T73 T75 T77 T79 T97 T99 T101 T103 T105 T107 T109 T111 T129 T131 T133 T135 T137 T139 T141 T143 T161 T163 T165 T167 T169 T171 T173 T175 = zetex:NMOSSOT23: MOS FET; OC_FARNELL: unknown; OC_NEWARK: unknown
T18 T20 T22 T24 T26 T28 T30 T32 T34 T36 T38 T40 T42 T44 T46 T48 T50 T52 T54 T56 T58 T60 T62 T64 T66 T68 T70 T72 T74 T76 T78 T80 T98 T100 T102 T104 T106 T108 T110 T112 T130 T132 T134 T136 T138 T140 T142 T144 T162 T164 T166 T168 T170 T172 T174 T176 = zetex:PMOSSOT23: MOS FET; OC_FARNELL: unknown; OC_NEWARK: unknown

## Module NOT
Ports: Q(io) A(io) GND(io) +5V(io)
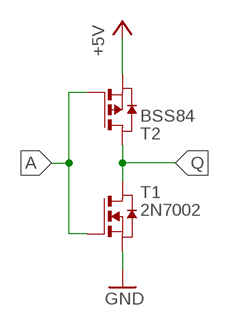
[diagram p7: schematic, module NOT, sheet 1]

### Parts
T1  2N7002  NMOSSOT23  [SOT-23]
T2  BSS84  PMOSSOT23  [SOT-23]

### Nets
+5V: T2.2(S)
A: T1.3(G) T2.3(G)
GND: T1.2(S)
Q: T1.1(D) T2.1(D)

### Library data of the parts
T1 = zetex:NMOSSOT23: MOS FET; OC_FARNELL: unknown; OC_NEWARK: unknown
T2 = zetex:PMOSSOT23: MOS FET; OC_FARNELL: unknown; OC_NEWARK: unknown

## Module NOR_3IN
Ports: +5V(io) GND(io) A(io) B(io) Q(io) C(io)
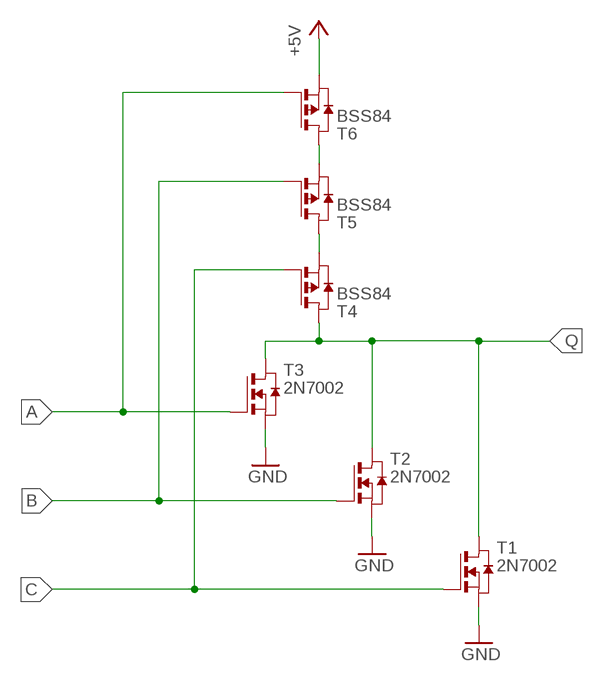
[diagram p8: schematic, module NOR_3IN, sheet 1]

### Parts
T1  2N7002  NMOSSOT23  [SOT-23]
T2  2N7002  NMOSSOT23  [SOT-23]
T3  2N7002  NMOSSOT23  [SOT-23]
T4  BSS84  PMOSSOT23  [SOT-23]
T5  BSS84  PMOSSOT23  [SOT-23]
T6  BSS84  PMOSSOT23  [SOT-23]

### Nets
+5V: T6.2(S)
A: T3.3(G) T6.3(G)
B: T2.3(G) T5.3(G)
C: T1.3(G) T4.3(G)
GND: T1.2(S) T2.2(S) T3.2(S)
N$1: T4.2(S) T5.1(D)
N$2: T5.2(S) T6.1(D)
Q: T1.1(D) T2.1(D) T3.1(D) T4.1(D)

### Library data of the parts
T1-T3 = zetex:NMOSSOT23: MOS FET; OC_FARNELL: unknown; OC_NEWARK: unknown
T4-T6 = zetex:PMOSSOT23: MOS FET; OC_FARNELL: unknown; OC_NEWARK: unknown

## Board
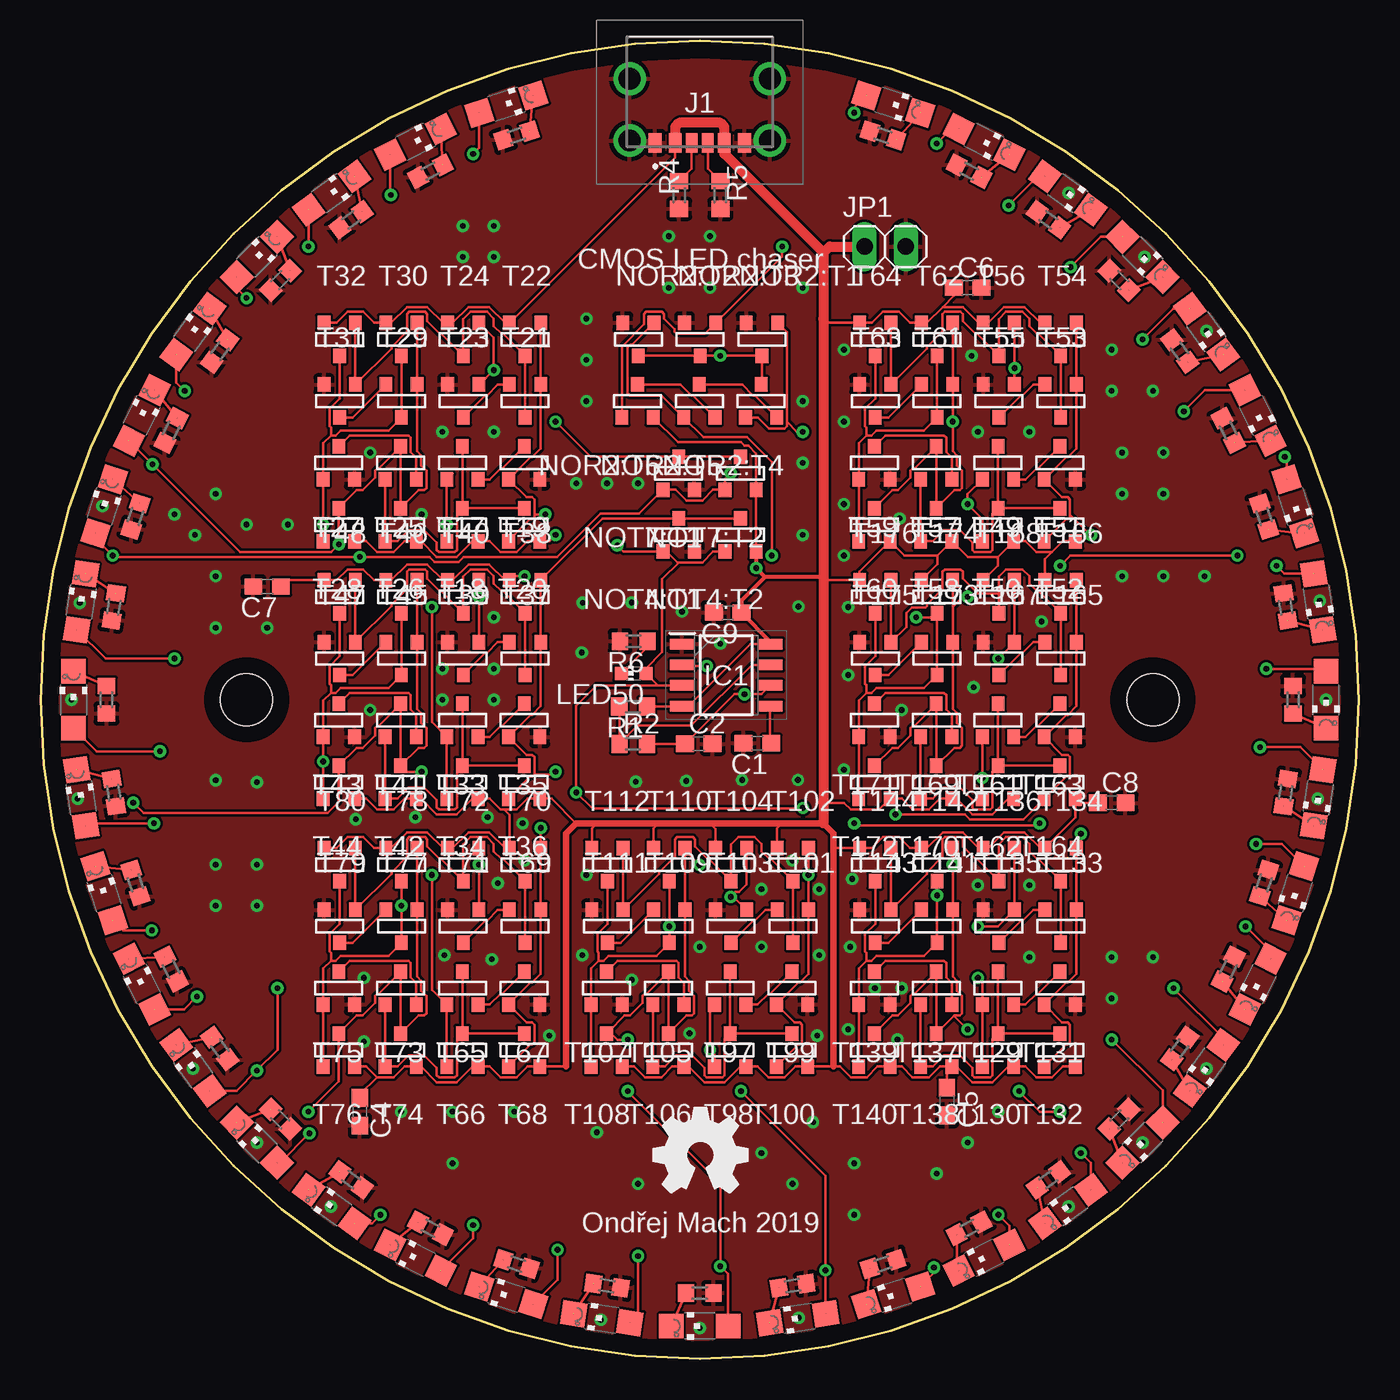
[diagram p9: board, top side]
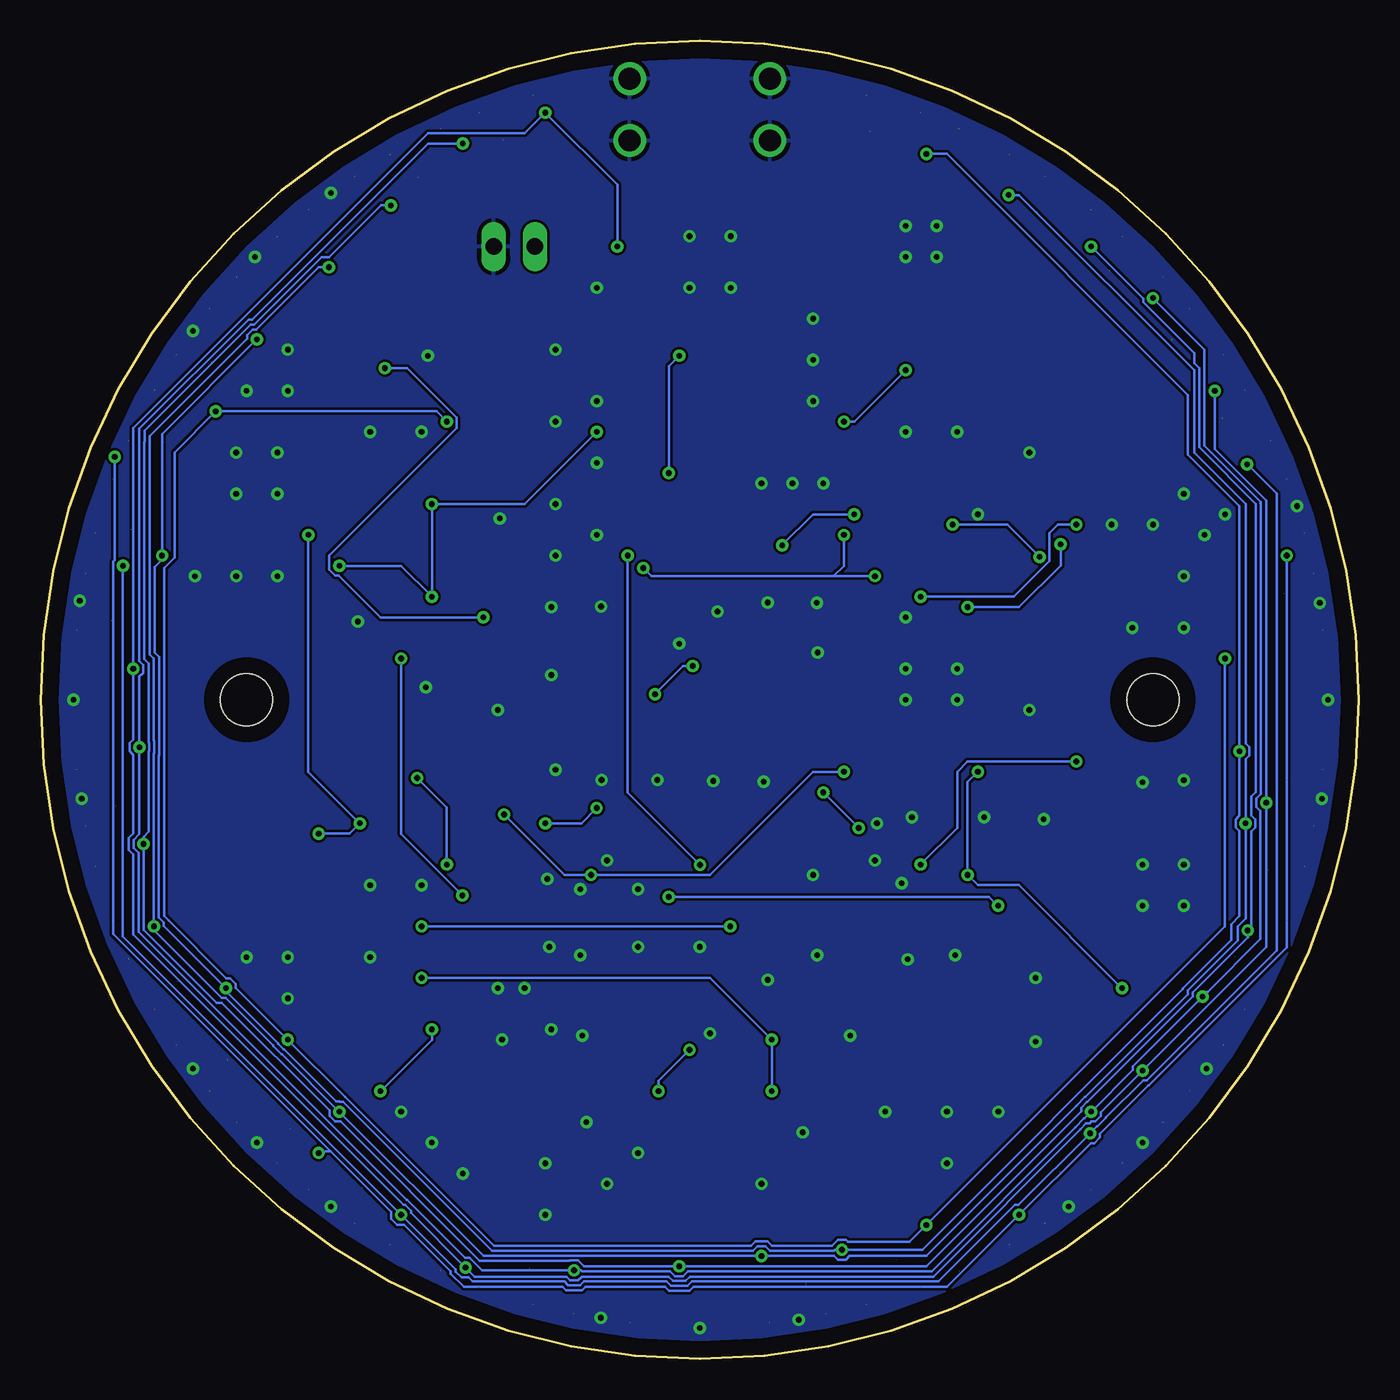
[diagram p10: board, bottom side, seen from below]

Size 81.28 x 81.28 mm. Coordinates in mm from the lower left corner, seen from the top.
Outline: 0,40.64 arc180 81.28,40.64 arc180 0,40.64
Copper layers (1*16): Top 0.035mm / dielectric 1.5mm / Bottom 0.035mm
Design rules "default *": minimum track width 6mil, minimum drill 0.35mm, track to track 6mil, track to pad 6mil, pad to pad 6mil, via to via 6mil, smd to smd 6mil, copper to edge 40mil, drill to drill 6mil, minimum pad ring 10mil, minimum via ring 8mil, stop-mask expansion 4mil, vias tented up to drill 20mil, thermal gap 10mil
Holes 3.2 mm at 12.7,40.64 68.58,40.64

### Footprints (pad centres in the part's own frame; a part is rotated, then mirrored left to right if it is on the bottom)
C0603 = smd 1.1 x 1: 1 -0.85,0; 2 0.85,0
SOIC127P600X175-8N = smd 1.525 x 0.65: 1 -2.712,1.905; 2 -2.712,0.635; 3 -2.712,-0.635; 4 -2.712,-1.905; 5 2.712,-1.905; 6 2.712,-0.635; 7 2.712,0.635; 8 2.712,1.905
TYPEC31M17 = smd 0.7 x 1.2: A5 -0.5,2.5; B5 0.5,2.5 | smd 0.76 x 1.2: A9 1.52,2.5; B9 -1.52,2.5 | smd 0.8 x 1.2: A12 2.75,2.5; B12 -2.75,2.5 | drill 1.346 pad 2: MH1 -4.32,-1.45; MH2 4.32,-1.45; MH3 4.32,2.35; MH4 -4.32,2.35
1X02 = drill 1.016 long: 1 -1.27,0; 2 1.27,0
CHIPLED_1206 = smd 1.5 x 1.5: A 0,-1.75; C 0,1.75
CHIP-LED0603 = smd 0.8 x 0.8: A 0,-0.75; C 0,0.75
SOT-23 = smd 0.787 x 0.889: 1 0.025,-1.016; 2 -0.94,1.016; 3 0.991,1.016
R0603 = smd 1 x 1.1: 1 -0.85,0; 2 0.85,0

### Placement (x,y rotation side)
C1  44.2,37.96 180 top
C2  40.58,37.92 0 top
C4  19.68,15.24 270 top
C5  55.88,15.88 270 top
C6  57.15,66.04 0 top
C7  13.97,47.62 180 top
C8  66.04,34.29 0 top
C9  42.36,46.01 180 top
IC1  42.27,42.16 0 top
J1  40.64,77.47 180 top
JP1  52.07,68.58 0 top
LED3  52.57,77.36 252 top
LED4  58.17,75.04 243 top
LED5  63.33,71.87 234 top
LED6  67.94,67.94 225 top
LED7  71.87,63.33 216 top
LED8  75.04,58.17 207 top
LED9  77.36,52.57 198 top
LED10  78.77,46.68 189 top
LED11  79.25,40.64 180 top
LED12  78.77,34.6 171 top
LED13  77.36,28.71 162 top
LED14  75.04,23.11 153 top
LED15  71.87,17.95 144 top
LED16  67.94,13.34 135 top
LED17  63.33,9.41 126 top
LED18  58.17,6.24 117 top
LED19  52.57,3.92 108 top
LED20  46.68,2.51 99 top
LED21  40.64,2.03 90 top
LED22  34.6,2.51 81 top
LED23  28.71,3.92 72 top
LED24  23.11,6.24 63 top
LED25  17.95,9.41 54 top
LED26  13.34,13.34 45 top
LED27  9.41,17.95 36 top
LED28  6.24,23.11 27 top
LED29  3.92,28.71 18 top
LED30  2.51,34.6 9 top
LED31  2.03,40.64 0 top
LED32  2.51,46.68 351 top
LED33  3.92,52.57 342 top
LED34  6.24,58.17 333 top
LED35  9.41,63.33 324 top
LED36  13.34,67.94 315 top
LED37  17.95,71.87 306 top
LED38  23.11,75.04 297 top
LED39  28.71,77.36 288 top
LED50  36.56,42.27 90 top
NOR2:T1  2N7002  [SOT-23]  44.45,62.87 0 top
NOR2:T2  2N7002  [SOT-23]  36.83,62.87 0 top
NOR2:T3  2N7002  [SOT-23]  40.64,62.87 0 top
NOR2:T4  BSS84  [SOT-23]  44.45,59.05 180 top
NOR2:T5  BSS84  [SOT-23]  40.64,59.05 180 top
NOR2:T6  BSS84  [SOT-23]  36.83,59.05 180 top
NOT4:T1  2N7002  [SOT-23]  39.37,50.8 180 top
NOT4:T2  BSS84  [SOT-23]  43.18,50.8 180 top
NOT7:T1  2N7002  [SOT-23]  39.37,54.61 180 top
NOT7:T2  BSS84  [SOT-23]  43.18,54.61 180 top
R1  36.53,40.22 180 top
R2  36.54,37.92 0 top
R4  39.37,71.75 90 top
R5  41.91,71.75 270 top
R6  36.57,44.25 180 top
R103  51.94,75.43 342 top
R104  57.25,73.23 333 top
R105  62.14,70.23 324 top
R106  66.5,66.5 315 top
R107  70.23,62.14 306 top
R108  73.23,57.25 297 top
R109  75.43,51.94 288 top
R110  76.77,46.36 279 top
R111  77.22,40.64 270 top
R112  76.77,34.92 261 top
R113  75.43,29.34 252 top
R114  73.23,24.03 243 top
R115  70.23,19.14 234 top
R116  66.5,14.78 225 top
R117  62.14,11.05 216 top
R118  57.25,8.05 207 top
R119  51.94,5.85 198 top
R120  46.36,4.51 189 top
R121  40.64,4.06 180 top
R122  34.92,4.51 171 top
R123  29.34,5.85 162 top
R124  24.03,8.05 153 top
R125  19.14,11.05 144 top
R126  14.78,14.78 135 top
R127  11.05,19.14 126 top
R128  8.05,24.03 117 top
R129  5.85,29.34 108 top
R130  4.51,34.92 99 top
R131  4.06,40.64 90 top
R132  4.51,46.36 81 top
R133  5.85,51.94 72 top
R134  8.05,57.25 63 top
R135  11.05,62.14 54 top
R136  14.78,66.5 45 top
R137  19.14,70.23 36 top
R138  24.03,73.23 27 top
R139  29.34,75.43 18 top
T17  26.04,55.24 180 top
T18  26.04,51.44 180 top
T19  29.84,55.24 180 top
T20  29.84,51.44 180 top
T21  29.84,59.05 0 top
T22  29.84,62.87 0 top
T23  26.04,59.05 0 top
T24  26.04,62.87 0 top
T25  22.23,55.24 180 top
T26  22.23,51.44 180 top
T27  18.41,55.24 180 top
T28  18.41,51.44 180 top
T29  22.23,59.05 0 top
T30  22.23,62.87 0 top
T31  18.41,59.05 0 top
T32  18.41,62.87 0 top
T33  26.04,39.37 180 top
T34  26.04,35.56 180 top
T35  29.84,39.37 180 top
T36  29.84,35.56 180 top
T37  29.84,43.18 0 top
T38  29.84,46.99 0 top
T39  26.04,43.18 0 top
T40  26.04,46.99 0 top
T41  22.23,39.37 180 top
T42  22.23,35.56 180 top
T43  18.41,39.37 180 top
T44  18.41,35.56 180 top
T45  22.23,43.18 0 top
T46  22.23,46.99 0 top
T47  18.41,43.18 0 top
T48  18.41,46.99 0 top
T49  59.05,55.24 180 top
T50  59.05,51.44 180 top
T51  62.87,55.24 180 top
T52  62.87,51.44 180 top
T53  62.87,59.05 0 top
T54  62.87,62.87 0 top
T55  59.05,59.05 0 top
T56  59.05,62.87 0 top
T57  55.24,55.24 180 top
T58  55.24,51.44 180 top
T59  51.44,55.24 180 top
T60  51.44,51.44 180 top
T61  55.24,59.05 0 top
T62  55.24,62.87 0 top
T63  51.44,59.05 0 top
T64  51.44,62.87 0 top
T65  26.04,22.86 180 top
T66  26.04,19.05 180 top
T67  29.84,22.86 180 top
T68  29.84,19.05 180 top
T69  29.84,26.67 0 top
T70  29.84,30.48 0 top
T71  26.04,26.67 0 top
T72  26.04,30.48 0 top
T73  22.23,22.86 180 top
T74  22.23,19.05 180 top
T75  18.41,22.86 180 top
T76  18.41,19.05 180 top
T77  22.23,26.67 0 top
T78  22.23,30.48 0 top
T79  18.41,26.67 0 top
T80  18.41,30.48 0 top
T97  42.55,22.86 180 top
T98  42.55,19.05 180 top
T99  46.35,22.86 180 top
T100  46.35,19.05 180 top
T101  46.35,26.67 0 top
T102  46.35,30.48 0 top
T103  42.55,26.67 0 top
T104  42.55,30.48 0 top
T105  38.73,22.86 180 top
T106  38.73,19.05 180 top
T107  34.92,22.86 180 top
T108  34.92,19.05 180 top
T109  38.73,26.67 0 top
T110  38.73,30.48 0 top
T111  34.92,26.67 0 top
T112  34.92,30.48 0 top
T129  59.05,22.86 180 top
T130  59.05,19.05 180 top
T131  62.87,22.86 180 top
T132  62.87,19.05 180 top
T133  62.87,26.67 0 top
T134  62.87,30.48 0 top
T135  59.05,26.67 0 top
T136  59.05,30.48 0 top
T137  55.24,22.86 180 top
T138  55.24,19.05 180 top
T139  51.44,22.86 180 top
T140  51.44,19.05 180 top
T141  55.24,26.67 0 top
T142  55.24,30.48 0 top
T143  51.44,26.67 0 top
T144  51.44,30.48 0 top
T161  59.05,39.37 180 top
T162  59.05,35.56 180 top
T163  62.87,39.37 180 top
T164  62.87,35.56 180 top
T165  62.87,43.18 0 top
T166  62.87,46.99 0 top
T167  59.05,43.18 0 top
T168  59.05,46.99 0 top
T169  55.24,39.37 180 top
T170  55.24,35.56 180 top
T171  51.44,39.37 180 top
T172  51.44,35.56 180 top
T173  55.24,43.18 0 top
T174  55.24,46.99 0 top
T175  51.44,43.18 0 top
T176  51.44,46.99 0 top

### Tracks (layer width: path | path; a pad name or v marks a point on that pad's centre or on a via)
+5V  (via drill 0.35)
  Top 0.152: NOR2:T6.2 39.29,56.52 43.18,56.52 43.4,56.3 43.64,56.3 44.12,55.82 NOT7:T2.2 NOT4:T2.2 44.12,49.51 | 62.36,49.75 61.39,49.75 60.71,50.42 T50.2 59.02,49.44 | T52.2 63.04,50.42 62.36,49.75 | 59.02,49.44 57.16,49.44 T58.2 55.3,49.53 | 55.3,49.53 53.26,49.53 T60.2 50.49,48.54 T176.2 48.51,48.01 48.31,48.21 48.26,48.26 | 55.62,64.86 56.85,64.86 57.83,63.88 T56.2 58.42,63.88 59.4,64.86 60.67,64.86 61.65,63.88 T54.2 | 55.62,64.86 54.64,63.88 T62.2 53.59,63.88 52.91,64.55 51.94,64.55 51.26,63.88 T64.2 48.51,63.88 48.26,64.14 | 55.3,49.53 55.3,49 T174.2 | 59.02,49.44 59.02,48.91 T168.2 | 62.36,49.75 61.92,49.31 T166.2 | T162.2 59.66,34.54 58.68,33.57 57.45,33.57 56.47,34.54 T170.2 55.45,34.54 54.78,33.87 53.77,33.87 53.09,34.54 T172.2 51.7,33.87 49.96,33.87 49.54,34.29 48.26,34.29 | T132.2 63.04,18.03 62.36,17.36 61.39,17.36 60.71,18.03 T130.2 59.66,18.03 58.68,17.06 57.45,17.06 56.47,18.03 T138.2 | T138.2 55.45,18.03 54.78,17.36 53.77,17.36 53.09,18.03 T140.2 51.61,18.03 50.93,17.36 49.96,17.36 49.28,18.03 48.9,18.03 T100.2 46.53,18.03 45.85,17.36 44.88,17.36 44.2,18.03 T98.2 43.15,18.03 42.17,17.06 40.94,17.06 39.96,18.03 T106.2 38.94,18.03 38.27,17.36 37.26,17.36 36.58,18.03 T108.2 | 32.38,18.03 T68.2 30.02,18.03 29.34,17.36 28.37,17.36 27.69,18.03 T66.2 26.64,18.03 25.66,17.06 24.43,17.06 23.45,18.03 T74.2 22.43,18.03 21.76,17.36 20.75,17.36 | T76.2 20.07,18.03 20.75,17.36 | T80.2 18.24,31.5 18.92,32.17 19.89,32.17 20.57,31.5 T78.2 21.62,31.5 22.6,32.47 23.83,32.47 24.81,31.5 T72.2 25.4,31.5 26.38,32.47 27.65,32.47 28.62,31.5 T70.2 28.91,33.54 28.57,33.87
  Top 0.152: T44.2 20.07,34.54 20.75,33.87 21.76,33.87 22.43,34.54 T42.2 23.45,34.54 24.43,33.57 25.66,33.57 26.64,34.54 T34.2 27.69,34.54 28.37,33.87 28.57,33.87 | 28.57,33.87 29.34,33.87 30.02,34.54 T36.2 31.5,34.54 33.02,33.02 | 41.32,31.5 T104.2 | T104.2 41.91,31.5 | 45.13,31.5 T102.2 45.41,32.72 45.72,33.02 | 48.9,31.5 T144.2 51.26,31.5 51.94,32.17 52.91,32.17 53.59,31.5 T142.2 54.64,31.5 55.62,32.47 56.85,32.47 57.83,31.5 T136.2 58.42,31.5 59.4,32.47 60.67,32.47 61.65,31.5 T134.2 63.8,33.38 T164.2 64.06,34.29 C8.1 | T28.2 20.07,50.42 20.75,49.75 21.76,49.75 22.43,50.42 T26.2 23.45,50.42 24.43,49.44 25.66,49.44 26.64,50.42 T18.2 27.69,50.42 28.37,49.75 29.34,49.75 30.02,50.42 T20.2 31.37,50.42 v31.75,50.8 | T32.2 18.24,63.88 18.92,64.55 19.89,64.55 20.57,63.88 T30.2 21.62,63.88 22.6,64.86 23.83,64.86 24.81,63.88 T24.2 25.4,63.88 26.38,64.86 27.65,64.86 28.62,63.88 T22.2 28.96,63.88 39.12,74.05 J1.A9 | T112.2 33.98,32.72 34.29,33.02 | v29.84,48.26 29.16,48.26 T38.2 28.62,48.01 27.65,48.98 26.38,48.98 25.4,48.01 T40.2 24.81,48.01 23.83,48.98 22.6,48.98 21.62,48.01 T46.2 20.57,48.01 19.89,48.68 18.92,48.68 18.24,48.01 T48.2 15.2,48.01 C7.1 | 38.1,33.02 37.8,32.72 T110.2 | 41.27,33.02 41.6,32.69 T104.2 | C6.1 56.3,65.54 55.62,64.86 | C5.1 55.88,17.73 T138.2 | C4.1 19.68,16.3 20.75,17.36 | R1.1 39.53,40.22 IC1.4 39.95,40.25 43.76,44.06 IC1.8
  Top 0.254: NOT4:T2.2 v44.12,48.76 44.66,48.21 | 48.31,48.21 44.66,48.21 | 44.66,48.21 43.21,46.76 C9.1 44.98,44.24 IC1.8
  Top 0.406: 32.38,18.03 32.38,32.38 33.02,33.02 34.29,33.02 38.1,33.02 41.27,33.02 45.72,33.02 48.26,33.02 48.9,32.38 48.9,31.5 48.9,18.03
  Top 0.61: J1.A9 39.12,75.95 39.37,76.2 41.91,76.2 42.16,75.95 J1.B9 42.16,74.3 48.26,68.2 | 48.26,33.02 48.26,34.29 48.26,48.26 48.26,64.14 48.26,68.2 | 48.26,68.2 48.64,68.58 JP1.1
  Bottom 0.152: v29.84,48.26 32.38,48.26 | 32.38,48.26 31.75,48.9 v31.75,50.8 | v44.12,48.76 43.62,48.26 32.38,48.26
CLK  (via drill 0.35)
  Top 0.152: T22.3 T21.3 30.84,56.12 30.31,55.59 30.21,55.59 T19.3 29.96,53.12 30.31,53.12 30.44,52.99 30.44,52.07 | 30.44,52.07 30.44,51.91 30.31,51.78 30.19,51.78 28.85,50.44 T20.3 | T68.3 30.21,19.39 30.31,19.39 30.44,19.53 30.44,20.61 30.31,20.74 29.96,20.74 T67.3 30.21,23.2 30.31,23.2 30.84,23.73 T69.3 T70.3 v30.84,32.74 | T132.3 63.23,19.39 63.33,19.39 63.46,19.53 63.46,20.61 63.33,20.74 62.98,20.74 T131.3 63.23,23.2 63.33,23.2 63.86,23.73 T133.3 T134.3 64.14,31.77 v64.14,32.38 | T54.3 T53.3 63.86,56.12 63.33,55.59 63.23,55.59 T51.3 62.98,53.12 63.33,53.12 63.46,52.99 63.46,52.07 | 63.46,52.07 63.46,51.91 63.33,51.78 63.23,51.78 T52.3 | NOT4:T2.3 41.47,49.78 40.8,49.11 39.36,49.11 | 39.36,49.11 39.27,49.11 38.59,49.78 NOT4:T1.3 35.94,49.78 v35.56,50.16 | v31.11,52.07 30.44,52.07 | v50.16,33.02 50.29,32.89 61.47,32.89 v61.59,33.02 | 63.46,52.07 64.73,50.8 v64.77,50.8 | IC1.3 38.06,41.52 | 38.06,41.52 LED50.A 37.31,42.58 38.33,43.59 38.33,48.08 39.36,49.11 | 38.06,41.52 34.28,41.52 33.02,40.27 v33.02,34.92 34.02,33.93 46.96,33.93 v47,33.97
  Bottom 0.152: v64.14,32.38 62.23,32.38 v61.59,33.02 64.77,36.2 v64.77,50.8 | v35.56,50.16 33.66,52.07 v31.11,52.07 | v33.02,34.92 v30.84,32.74 | v47,33.97 47.94,33.02 v50.16,33.02
CLK_INV  (via drill 0.35)
  Top 0.152: 30.44,36.04 30.44,37.12 30.31,37.25 29.96,37.25 T35.3 30.21,39.71 30.31,39.71 30.84,40.24 T37.3 T38.3 34.65,51.82 NOT4:T1.1 NOT4:T2.1 | 30.44,36.04 30.31,35.9 30.19,35.9 28.85,34.57 T36.3 | T100.3 46.72,19.39 46.82,19.39 46.95,19.53 46.95,20.61 46.82,20.74 46.47,20.74 T99.3 46.72,23.2 46.82,23.2 47.35,23.73 T101.3 v47.35,29.84 T102.3 | T166.3 T165.3 63.86,40.24 63.33,39.71 63.23,39.71 T163.3 62.98,37.25 63.33,37.25 63.46,37.12 63.46,36.04 63.33,35.9 63.23,35.9 T164.3 60.59,33.26 57.29,33.26 56.98,33.57 53.64,33.57 v52.7,33.57 | v31.75,36.2 31.59,36.04 30.44,36.04
  Bottom 0.152: v47.35,29.84 40.01,29.84 33.66,36.2 v31.75,36.2 | v47.35,29.84 47.85,29.84 | v52.7,33.57 48.98,29.84 v47.35,29.84
GND  (via drill 0.35)
  other vias: 39.55,46.08 41.91,44.1 46.73,46.39 46.69,35.7 43.25,35.69 39.81,35.64 36.7,35.59 33.36,43.55 33.42,46.62 36.45,46.63 61.72,45.47 57.53,41.4 49.53,36.32 53.09,40.01 26.04,69.85 26.04,67.94 27.94,67.94 27.94,69.85 33.66,64.14 33.66,61.59 33.66,59.05 38.73,66.04 41.27,66.04 41.27,69.22 38.73,69.22 33.02,53.98 34.92,53.98 36.83,53.98 10.79,53.34 12.7,51.44 15.24,51.44 13.97,45.09 10.79,45.09 10.79,48.26 10.79,35.69 13.34,35.56 10.79,30.48 13.34,30.48 10.79,27.94 22.23,15.24 25.4,15.24 29.21,15.24 25.4,12.06 34.29,13.97 36.83,10.79 44.45,12.7 47.62,14.61 50.16,12.06 50.16,8.89 55.24,11.43 57.15,13.34 59.05,15.24 66.04,22.23 68.58,24.77 66.04,24.77 66.67,48.26 69.22,48.26 71.75,48.26 66.67,53.34 69.22,53.34 66.67,55.88 69.22,55.88 66.04,59.69 68.58,59.69 66.04,62.23 20.32,55.88 9.53,50.8 8.26,52.07 2.29,34.54 9.4,17.91 13.34,13.34 17.91,9.4 34.54,2.41 40.64,1.91 46.74,2.54 63.37,9.4 67.94,13.34 71.88,17.91 78.74,34.54 79.25,40.64 78.87,46.74 71.88,63.37 68.07,67.94 63.37,71.88 47.88,19.94 49.78,20.32 52.83,19.68 53.09,22.86 51.44,22.86 49.91,25.4 50.04,29.59 46.35,30.73 19.94,19.56 27.81,24.64 24.89,24.89 28.19,29.34 29.84,30.73 31.37,19.94 29.72,33.02 27.56,33.4 23.11,33.4 19.43,33.27 13.34,27.94 46.35,10.79 49.53,57.78 49.53,52.7 49.53,49.53 52.96,51.82 49.78,46.35 49.78,42.16 49.53,62.23 36.45,23.37 40.64,25.4 44.45,25.4 40.01,20.07 48.01,28.96 48.01,24.89 44.45,28.96 19.94,23.5 24.77,40.64 24.77,42.55 27.94,40.64 27.94,42.55 27.94,45.72 20.32,40.01 2.41,46.61 3.81,52.58 46.99,50.8 46.99,55.24 46.99,59.05 46.99,66.04 57.78,29.21 60.96,29.21 60.96,24.77 23.5,52.07 24.77,57.15 27.94,57.15 33.4,24.89 33.66,29.84 57.78,57.15 60.96,57.15 57.4,61.85 1.91,40.64
  pour Top: 0,40.64 arc-90 40.64,81.28 arc-90 81.28,40.64 arc-90 40.64,0 arc-90
  pour Bottom: 0,40.64 arc-90 40.64,81.28 arc-90 81.28,40.64 arc-90 40.64,0 arc-90
N$1  (via drill 0.35)
  Top 0.152: NOT7:T2.1 NOT7:T1.1 33.91,55.63 v31.75,57.78 | T23.3 27.05,60.07 v27.94,60.96 27.94,62.97 T24.3
  Bottom 0.152: v31.75,57.78 31.11,57.78 v27.94,60.96
N$2
  Top 0.152: LED50.C 37.42,43.88 R6.1
N$3
  Top 0.152: R1.2 R2.1 36.81,39.05 40.11,39.05 43.86,42.79 IC1.7
N$4  (2 unrouted)
  Top 0.152: LED9.C 77.47,50.91 R109.2
N$5
  Top 0.152: IC1.5 44.98,38.02 C1.1
N$7  (2 unrouted)
  Top 0.152: R117.2 LED17.C
N$8  (via drill 0.35)
  Top 0.152: R2.2 C2.1 42.79,40.98 v43.4,40.98 44.44,40.98 IC1.6 | v41.06,42.72 39.63,42.72 IC1.2
  Bottom 0.152: v43.4,40.98 41.66,42.72 v41.06,42.72
N$9  (2 unrouted)
  Top 0.152: R125.2 18.38,11.47 LED25.C
N$11  (2 unrouted)
  Top 0.152: LED33.C R133.2
N$13  (2 unrouted)
  Top 0.152: R106.2 LED6.C
N$16  (2 unrouted)
  Top 0.152: LED14.C 74.25,21.59 R114.2
N$17  (2 unrouted)
  Top 0.152: LED22.C R122.2
N$18  (2 unrouted)
  Top 0.152: LED30.C R130.2
N$21  (2 unrouted)
  Top 0.152: LED38.C R138.2
N$22  (2 unrouted)
  Top 0.152: R107.2 LED7.C
N$23  (2 unrouted)
  Top 0.152: R115.2 LED15.C
N$24  (2 unrouted)
  Top 0.152: LED23.C R123.2
N$25
  Top 0.152: LED31.C R131.2
N$26  (2 unrouted)
  Top 0.152: LED39.C R139.2
N$27  (2 unrouted)
  Top 0.152: R105.2 LED5.C
N$28  (2 unrouted)
  Top 0.152: R113.2 LED13.C
N$29
  Top 0.152: LED21.C R121.2
N$30  (2 unrouted)
  Top 0.152: LED29.C R129.2
N$31  (2 unrouted)
  Top 0.152: LED37.C R137.2
N$32  (2 unrouted)
  Top 0.152: LED8.C 75.56,56.61 R108.2
N$33  (2 unrouted)
  Top 0.152: R116.2 LED16.C
N$34  (2 unrouted)
  Top 0.152: LED24.C R124.2
N$35  (2 unrouted)
  Top 0.152: LED32.C R132.2
N$38  (2 unrouted)
  Top 0.152: R110.2 LED10.C
N$39  (2 unrouted)
  Top 0.152: LED18.C 56.49,5.57 R118.2
N$40  (2 unrouted)
  Top 0.152: LED26.C R126.2
N$41  (2 unrouted)
  Top 0.152: LED34.C R134.2
N$42  (2 unrouted)
  Top 0.152: R103.2 LED3.C
N$43
  Top 0.152: R111.2 LED11.C
N$44  (2 unrouted)
  Top 0.152: R119.2 LED19.C
N$45  (2 unrouted)
  Top 0.152: LED27.C R127.2
N$46
  Top 0.152: R5.1 41.14,73.38 J1.A5
N$47
  Top 0.152: R4.2 40.14,73.38 J1.B5
N$51  (2 unrouted)
  Top 0.152: LED35.C R135.2
N$52  (2 unrouted)
  Top 0.152: LED4.C 59.69,74.25 R104.2
N$53  (2 unrouted)
  Top 0.152: R112.2 LED12.C
N$54  (2 unrouted)
  Top 0.152: LED20.C R120.2
N$55  (2 unrouted)
  Top 0.152: R128.2 7.62,24.79 LED28.C
N$56  (2 unrouted)
  Top 0.152: LED36.C R136.2
N$68  (via drill 0.35)
  Top 0.152: 17.9,56.93 18.2,56.93 18.5,57.24 21.45,57.24 T29.1 T30.1 | 17.9,56.93 17.42,56.46 T27.3 v17.42,51.44 T28.3 | T32.1 18.44,59.2 17.82,58.58 17.82,57.5 17.9,57.42 17.9,56.93 | T39.3 v27.03,46.99 T40.3
  Bottom 0.152: v27.03,46.99 21.28,46.99 19.08,49.19 19.08,50.92 18.57,51.44 v17.42,51.44
N$69
  Top 0.152: T19.1 28.46,54.9 28.37,54.9 27.69,54.23 T17.2
N$70
  Top 0.152: T23.1 27.42,59.4 27.51,59.4 28.19,60.07 T21.2
N$71
  Top 0.152: T25.2 23.16,55.58 22.82,55.92 22.82,56.8 22.69,56.93 19.06,56.93 T27.1
N$72
  Top 0.152: T29.2 19.25,58.04 T31.1
N$73
  Top 0.152: T25.3 T26.3 22,50.42 22.68,51.09 23.65,51.09 24.42,50.32 24.42,49.88 24.56,49.75 25.53,49.75 25.67,49.88 25.67,52.11 T18.1 | T18.1 T17.1 | T18.1 T20.1
N$74
  Top 0.152: T32.3 T31.3 21.63,62.29 21.63,62.39 22.59,63.35 22.59,64.42 22.73,64.55 23.7,64.55 23.84,64.42 23.84,63.98 24.61,63.21 24.7,63.21 T24.1 26.06,64.11 26.5,64.55 27.51,64.55 27.93,64.14 27.94,64.14 27.94,63.69 28.42,63.21 28.51,63.21 T22.1 T21.1
N$79  (via drill 0.35)
  Top 0.152: T44.3 v17.42,36.83 T43.3 17.42,40.58 17.9,41.06 | 17.9,41.06 18.2,41.06 18.5,41.36 21.45,41.36 T45.1 T46.1 | T48.1 18.44,43.33 17.82,42.7 17.82,41.62 17.9,41.54 17.9,41.06 | T71.3 v27.03,30.48 T72.3
  Bottom 0.152: v27.03,30.48 24.77,32.74 24.77,36.2 24.13,36.83 v17.42,36.83
N$80
  Top 0.152: T35.1 28.46,39.03 28.37,39.03 27.69,38.35 T33.2
N$81
  Top 0.152: T39.1 27.42,43.52 27.51,43.52 28.19,44.2 T37.2
N$82
  Top 0.152: T41.2 23.16,39.7 22.82,40.04 22.82,40.92 22.69,41.06 19.06,41.06 T43.1
N$83
  Top 0.152: T45.2 19.25,42.16 T47.1
N$84
  Top 0.152: T41.3 T42.3 22,34.54 22.68,35.22 23.65,35.22 24.42,34.45 24.42,34.01 24.56,33.87 25.53,33.87 25.67,34.01 25.67,36.23 T34.1 | T34.1 T33.1 | T34.1 T36.1
N$85
  Top 0.152: T48.3 T47.3 21.63,46.42 21.63,46.51 22.59,47.48 22.59,48.55 22.73,48.68 23.7,48.68 23.84,48.55 23.84,48.1 24.61,47.33 24.7,47.33 T40.1 26.06,48.23 26.5,48.68 27.51,48.68 27.93,48.26 27.94,48.26 27.94,47.81 28.42,47.33 28.51,47.33 T38.1 T37.1
N$90
  Top 0.152: T60.3 T59.3 50.44,56.46 50.92,56.93 | 50.92,56.93 51.22,56.93 51.52,57.24 54.47,57.24 T61.1 T62.1 | T64.1 51.46,59.2 50.84,58.58 50.84,57.5 50.92,57.42 50.92,56.93
N$91
  Top 0.152: T51.1 61.48,54.9 61.39,54.9 60.71,54.23 T49.2
N$92
  Top 0.152: T55.1 60.44,59.4 60.53,59.4 61.21,60.07 T53.2
N$93
  Top 0.152: T57.2 56.19,55.58 55.84,55.92 55.84,56.8 55.71,56.93 52.08,56.93 T59.1
N$94
  Top 0.152: T61.2 52.27,58.04 T63.1
N$95
  Top 0.152: T57.3 T58.3 55.02,50.42 55.7,51.09 56.67,51.09 57.44,50.32 57.44,49.88 57.58,49.75 58.55,49.75 58.69,49.88 58.69,52.11 T50.1 | T50.1 T49.1 | T50.1 T52.1
N$96
  Top 0.152: T64.3 T63.3 54.65,62.29 54.65,62.39 55.61,63.35 55.61,64.42 55.75,64.55 56.72,64.55 56.86,64.42 56.86,63.98 57.63,63.21 57.72,63.21 T56.1 59.08,64.11 59.52,64.55 60.53,64.55 60.95,64.14 60.96,64.14 60.96,63.69 61.44,63.21 61.53,63.21 T54.1 T53.1
N$101  (via drill 0.35)
  Top 0.152: T76.3 T75.3 17.42,24.07 17.9,24.55 | 17.9,24.55 18.2,24.55 18.5,24.85 21.45,24.85 T77.1 v22.25,27.94 T78.1 | T80.1 18.44,26.82 17.82,26.19 17.82,25.11 17.9,25.03 17.9,24.55 | T103.3 42.73,28.49 v42.55,28.49 42.85,28.79 43.06,28.79 43.54,29.27 T104.3
  Bottom 0.152: v22.25,27.94 22.8,28.49 v42.55,28.49
N$102
  Top 0.152: T67.1 28.46,22.52 28.37,22.52 27.69,21.84 T65.2
N$103
  Top 0.152: T71.1 27.42,27.01 27.51,27.01 28.19,27.69 T69.2
N$104
  Top 0.152: T73.2 23.16,23.19 22.82,23.53 22.82,24.41 22.69,24.55 19.06,24.55 T75.1
N$105
  Top 0.152: T77.2 19.25,25.65 T79.1
N$106
  Top 0.152: T73.3 T74.3 22,18.03 22.68,18.71 23.65,18.71 24.42,17.94 24.42,17.5 24.56,17.36 25.53,17.36 25.67,17.5 25.67,19.72 T66.1 | T66.1 T65.1 | T66.1 T68.1
N$107
  Top 0.152: T80.3 T79.3 21.63,29.91 21.63,30 22.59,30.97 22.59,32.03 22.73,32.17 23.7,32.17 23.84,32.03 23.84,31.59 24.61,30.82 24.7,30.82 T72.1 26.06,31.73 26.5,32.17 27.51,32.17 27.93,31.75 27.94,31.75 27.94,31.3 28.42,30.82 28.51,30.82 T70.1 T69.1
N$123  (via drill 0.35)
  Top 0.152: T108.3 T107.3 33.93,24.07 34.41,24.55 | 34.41,24.55 34.71,24.55 35.01,24.85 37.96,24.85 T109.1 v38.76,26.67 T110.1 | T112.1 34.95,26.82 34.33,26.19 34.33,25.11 34.41,25.03 34.41,24.55 | v57.78,26.67 59.03,26.67 T135.3 T136.3
  Bottom 0.152: v38.76,26.67 v57.78,26.67
N$124
  Top 0.152: T99.1 44.97,22.52 44.88,22.52 44.2,21.84 T97.2
N$125
  Top 0.152: T103.1 43.93,27.01 44.02,27.01 44.7,27.69 T101.2
N$126
  Top 0.152: T105.2 39.67,23.19 39.33,23.53 39.33,24.41 39.2,24.55 35.57,24.55 T107.1
N$127
  Top 0.152: T109.2 35.76,25.65 T111.1
N$128
  Top 0.152: T105.3 T106.3 38.51,18.03 39.19,18.71 40.16,18.71 40.93,17.94 40.93,17.5 41.07,17.36 42.04,17.36 42.18,17.5 42.18,19.72 T98.1 | T98.1 T97.1 | T98.1 T100.1
N$129
  Top 0.152: T112.3 T111.3 38.14,29.91 38.14,30 39.1,30.97 39.1,32.03 39.24,32.17 40.21,32.17 40.35,32.03 40.35,31.59 41.12,30.82 41.21,30.82 T104.1 42.57,31.73 43.02,32.17 44.02,32.17 44.44,31.75 44.45,31.75 44.45,31.3 44.93,30.82 45.02,30.82 T102.1 T101.1
N$145  (via drill 0.35)
  Top 0.152: T140.3 T139.3 50.44,24.07 50.92,24.55 | 50.92,24.55 51.22,24.55 51.52,24.85 54.47,24.85 T141.1 v55.27,28.57 T142.1 | T144.1 51.46,26.82 50.84,26.19 50.84,25.11 50.92,25.03 50.92,24.55 | v59.05,43.18 60.05,44.17 T167.3 T168.3
  Bottom 0.152: v55.27,28.57 59.05,32.36 v59.05,43.18
N$146
  Top 0.152: T131.1 61.48,22.52 61.39,22.52 60.71,21.84 T129.2
N$147
  Top 0.152: T135.1 60.44,27.01 60.53,27.01 61.21,27.69 T133.2
N$148
  Top 0.152: T137.2 56.19,23.19 55.84,23.53 55.84,24.41 55.71,24.55 52.08,24.55 T139.1
N$149
  Top 0.152: T141.2 52.27,25.65 T143.1
N$150
  Top 0.152: T137.3 T138.3 55.02,18.03 55.7,18.71 56.67,18.71 57.44,17.94 57.44,17.5 57.58,17.36 58.55,17.36 58.69,17.5 58.69,19.72 T130.1 | T130.1 T129.1 | T130.1 T132.1
N$151
  Top 0.152: T144.3 T143.3 54.65,29.91 54.65,30 55.61,30.97 55.61,32.03 55.75,32.17 56.72,32.17 56.86,32.03 56.86,31.59 57.63,30.82 57.72,30.82 T136.1 59.08,31.73 59.52,32.17 60.53,32.17 60.95,31.75 60.96,31.75 60.96,31.3 61.44,30.82 61.53,30.82 T134.1 T133.1
N$167  (via drill 0.35)
  Top 0.152: T172.3 T171.3 50.44,40.58 50.92,41.06 | 50.92,41.06 51.22,41.06 51.52,41.36 54.47,41.36 T173.1 T174.1 55.02,45.72 v53.98,45.72 | T176.1 51.46,43.33 50.84,42.7 50.84,41.62 50.92,41.54 50.92,41.06 | T56.3 v60.05,61.09 T55.3
  Bottom 0.152: v53.98,45.72 60.33,45.72 62.89,48.29 63.12,48.29 63.5,48.67 63.5,49.53 55.63,57.4 55.63,58.04 58.68,61.09 v60.05,61.09
N$168
  Top 0.152: T163.1 61.48,39.03 61.39,39.03 60.71,38.35 T161.2
N$169
  Top 0.152: T167.1 60.44,43.52 60.53,43.52 61.21,44.2 T165.2
N$170
  Top 0.152: T169.2 56.19,39.7 55.84,40.04 55.84,40.92 55.71,41.06 52.08,41.06 T171.1
N$171
  Top 0.152: T173.2 52.27,42.16 T175.1
N$172
  Top 0.152: T169.3 T170.3 55.02,34.54 55.7,35.22 56.67,35.22 57.44,34.45 57.44,34.01 57.58,33.87 58.55,33.87 58.69,34.01 58.69,36.23 T162.1 | T162.1 T161.1 | T162.1 T164.1
N$173
  Top 0.152: T176.3 T175.3 53.37,45.14 53.37,45.97 53.72,46.33 54.56,46.33 54.65,46.42 54.65,46.51 55.61,47.48 55.61,48.55 55.75,48.68 56.72,48.68 56.86,48.55 56.86,48.11 57.78,47.19 59.07,47.19 59.08,47.21 | T168.1 59.08,47.21 | 59.08,47.21 59.08,48.23 59.52,48.68 60.53,48.68 60.95,48.26 60.96,48.26 60.96,47.81 61.44,47.33 61.53,47.33 T166.1 T165.1
NOR2:N$1
  Top 0.152: NOR2:T4.2 44.03,59.4 43.94,59.4 43.26,60.07 NOR2:T5.1
NOR2:N$2
  Top 0.152: NOR2:T5.2 40.22,59.4 40.13,59.4 39.45,60.07 NOR2:T6.1
OUT1  (via drill 0.35)  (4 unrouted)
  Top 0.152: NOR2:T4.1 44.48,60.12 NOR2:T1.1 v41.91,61.85 NOR2:T3.1 NOR2:T2.1 | 25.4,54.59 T17.3 v25.04,51.44 T18.3 | LED9.A 76.82,55.51 v76.71,55.62 | v20.95,8.89 20.44,8.38 LED25.A | LED33.A 3.38,50.59 v4.45,49.53 4.53,49.44 18.04,49.44 v19.68,49.44 20.62,49.44 24,49.44 24.3,49.14 25.79,49.14 26.09,49.44 31.84,49.44 34.52,52.12 36.91,52.12 NOT7:T1.3 39.15,53.59 39.82,52.92 40.8,52.92 41.47,53.59 NOT7:T2.3 42.19,54.25 v42.55,54.61 | v64.14,12.7 64.75,12.09 LED17.A
  Bottom 0.152: v19.68,49.44 21.68,51.44 v25.04,51.44 | v76.71,55.62 76.71,49.24 76.81,49.15 76.81,26.21 63.4,12.8 | 63.4,12.8 59.66,9.07 59.66,8.64 59.31,8.28 58.88,8.28 55.99,5.39 55.99,5.25 55.18,4.45 49.09,4.45 48.89,4.25 47.88,4.25 47.68,4.45 42.79,4.45 42.54,4.19 41.28,4.19 41.03,4.45 25.4,4.45 v20.95,8.89 16.54,13.3 16.32,13.3 15.96,13.66 15.96,13.88 12.98,16.87 12.96,16.87 4.45,25.38 v4.45,49.53 | v42.55,54.61 42.55,61.21 v41.91,61.85 | 63.4,12.8 64.03,12.8 v64.14,12.7
OUT2  (via drill 0.35)  (4 unrouted)
  Top 0.152: T30.3 T29.3 23.22,55.95 23.47,55.7 23.47,55.09 23.79,54.77 23.79,53.69 23.65,53.56 23.3,53.56 T26.1 T25.1 20.84,54.9 20.75,54.9 20.61,54.77 20.61,54.33 19.84,53.56 19.49,53.56 T28.1 v18.39,50.22 17.91,49.75 12.31,49.75 v6.9,55.16 LED34.A | v16.57,13.91 14.76,12.1 LED26.A | v59.05,8.89 59.73,8.22 LED18.A | v76.2,48.9 76.69,48.41 LED10.A | v24.13,46.35 24.13,39.27 T33.3 T34.3
  Bottom 0.152: v6.9,55.16 5.08,53.34 5.08,25.18 13.08,17.17 13.31,17.17 15.6,14.88 15.6,14.86 16.13,14.33 16.15,14.33 v16.57,13.91 20.98,9.5 21.21,9.5 25.93,4.78 41.13,4.78 41.41,4.5 42.41,4.5 42.69,4.78 47.78,4.78 48.01,4.55 48.77,4.55 48.99,4.78 54.65,4.78 54.9,5.02 55.33,5.02 55.68,5.38 55.68,5.52 v59.05,8.89 76.2,26.04 v76.2,48.9 | v24.13,46.35 20.95,46.35 18.39,48.92 v18.39,50.22
OUT3  (via drill 0.35)  (4 unrouted)
  Top 0.152: T46.3 T45.3 23.22,40.08 23.47,39.83 23.47,39.21 23.79,38.89 23.79,37.81 23.65,37.68 23.3,37.68 T42.1 | T42.1 T41.1 20.84,39.03 20.75,39.03 20.61,38.89 20.61,38.45 19.84,37.68 19.49,37.68 T44.1 18.39,34.35 17.7,33.66 6.35,33.66 v5.71,34.29 | NOR2:T6.3 35.84,62.43 37.2,63.78 37.2,64.42 37.33,64.55 38.31,64.55 38.44,64.42 38.44,64.14 39.08,63.5 39.08,63.34 39.21,63.21 40.96,63.21 NOR2:T3.3 45.72,67.97 v45.72,68.58 | LED35.A 8.38,60.2 v8.89,59.69 | LED27.A 12.09,16.53 v13.34,17.78 14.61,19.05 v14.61,22.86 | T66.3 T65.3 24.13,22.76 v24.13,29.84 | v55.08,5.63 55.08,5.3 LED19.A | v75.56,42.55 79.09,42.55 LED11.A | v50.16,76.83 50.16,77.16 LED3.A | v23.5,36.2 22.58,36.2 T42.1
  Bottom 0.152: v8.89,59.69 8.89,56.11 5.71,52.93 v5.71,34.29 5.71,25.4 v13.34,17.78 15.9,15.21 15.9,14.99 16.26,14.63 16.48,14.63 16.6,14.52 16.82,14.52 17.18,14.16 17.18,14.14 26.24,5.08 41.26,5.08 41.53,4.8 42.29,4.8 42.56,5.08 47.91,5.08 48.14,4.85 48.64,4.85 48.86,5.08 54.53,5.08 v55.08,5.63 58.45,9 58.45,9.14 58.8,9.5 58.9,9.5 75.56,26.16 75.56,31.1 75.84,31.37 75.84,32.13 75.56,32.4 75.56,37.24 75.79,37.47 75.79,37.97 75.56,38.2 v75.56,42.55 75.56,57.4 57.4,75.56 51.44,75.56 v50.16,76.83 45.72,72.39 v45.72,68.58 | v23.5,36.2 24.13,35.56 v24.13,29.84 23.5,29.21 20.95,29.21 v14.61,22.86
OUT4  (via drill 0.35)  (5 unrouted)
  Top 0.152: T78.3 T77.3 23.22,23.57 23.47,23.32 23.47,22.7 23.79,22.38 23.79,21.3 23.65,21.17 23.3,21.17 T74.1 T73.1 20.84,22.52 20.75,22.52 20.61,22.38 20.61,21.94 19.84,21.17 19.49,21.17 T76.1 18.39,17.12 v16.51,15.24 | LED36.A 12.1,66 v12.7,65.41 | v9.64,22.34 8.85,21.55 LED28.A | LED20.A 48.39,2.8 v48.39,5.46 48.39,11.3 v43.18,16.51 | T98.3 41.55,18.77 v41.27,19.05 41.27,21.57 T97.3 | v75.18,37.72 77.66,37.72 LED12.A | v55.24,74.93 56.15,75.83 LED4.A
  Bottom 0.152: v12.7,65.41 9.53,62.23 9.53,56.31 6.04,52.83 6.04,34.82 6.32,34.54 6.32,34.04 6.07,33.79 6.07,25.88 9.31,22.64 9.34,22.64 v9.64,22.34 13.94,18.03 13.94,17.81 v16.51,15.24 16.93,14.82 16.95,14.82 17.48,14.29 17.48,14.27 26.34,5.41 41.36,5.41 41.66,5.11 42.16,5.11 42.46,5.41 47.91,5.41 47.96,5.46 v48.39,5.46 54.05,5.46 54.83,6.24 55.11,6.24 58.68,9.8 58.72,9.8 75.23,26.32 75.23,31.2 75.54,31.5 75.54,32 75.18,32.35 v75.18,37.72 75.18,42.07 74.96,42.29 74.96,42.8 75.18,43.02 75.18,57.35 68.45,64.08 68.23,64.08 57.38,74.93 v55.24,74.93 | v41.27,19.05 43.18,17.14 v43.18,16.51
OUT5  (via drill 0.35)  (4 unrouted)
  Top 0.152: T108.1 35.04,20.21 | 35.04,20.21 36.01,21.17 36.35,21.17 37.12,21.94 37.12,22.38 37.26,22.52 37.35,22.52 T105.1 T106.1 39.81,21.17 40.16,21.17 40.3,21.3 40.3,22.38 39.98,22.7 39.98,23.32 39.73,23.57 T109.3 T110.3 39.73,31.36 v40.62,30.46 | v45.09,49.53 45.09,55.29 43.55,56.82 40.87,56.82 NOR2:T5.3 38.29,59.4 36.32,59.4 36.18,59.53 36.18,62.34 36.37,62.52 36.46,62.52 NOR2:T2.3 | LED37.A 16.53,68.6 v16.51,68.58 | LED29.A 5.09,26.42 v6.86,26.42 | LED21.A 42.39,5.24 v41.91,5.71 41.91,10.79 v36.2,16.51 | v74.93,31.75 76.52,31.75 LED13.A | v59.69,71.12 61.47,72.9 LED5.A | T130.3 T129.3 58.06,23.22 v57.78,23.5 | v36.2,19.68 35.56,19.68 35.04,20.21
  Bottom 0.152: v45.09,49.53 45.09,34.92 v40.62,30.46 | v16.51,68.58 13.31,65.38 13.31,65.15 10.16,62.01 10.16,61.39 9.86,61.09 9.86,56.21 6.35,52.7 6.35,34.94 6.63,34.67 6.63,33.52 6.38,33.27 6.38,32.77 6.63,32.52 6.63,26.65 v6.86,26.42 6.86,25.97 10.24,22.59 10.24,22.35 16.74,15.85 16.76,15.85 17.12,15.49 17.12,15.27 26.67,5.71 v41.91,5.71 47.78,5.71 48.14,6.07 48.64,6.07 48.66,6.04 54.2,6.04 62.79,14.63 63.12,14.63 63.47,14.99 63.47,15.31 70.11,21.95 70.43,21.95 74.93,26.45 v74.93,31.75 74.93,32.18 74.6,32.51 74.6,37.45 74.58,37.47 74.58,37.97 74.6,37.99 74.6,42.87 74.88,43.15 74.88,56.52 74.85,56.54 74.85,57.24 68.32,63.78 68.1,63.78 63.96,67.92 63.48,67.92 60.27,71.12 v59.69,71.12 | v36.2,16.51 v36.2,19.68 40.01,23.5 v57.78,23.5
OUT6  (via drill 0.35)  (5 unrouted)
  Top 0.152: T142.3 v56.24,30.48 T141.3 56.24,23.57 56.49,23.32 56.49,22.7 56.81,22.38 56.81,21.3 56.67,21.17 56.33,21.17 56.31,21.16 | T140.1 52.51,21.17 52.86,21.17 53.63,21.94 53.63,22.38 53.77,22.52 53.86,22.52 T137.1 T138.1 56.31,21.16 | LED38.A 21.55,71.79 v21.59,71.75 | v6.99,33.02 2.93,33.02 LED30.A | v36.83,6.35 36.83,2.73 LED22.A | v62.87,15.24 61.59,15.24 v60.33,16.51 | v57.15,20.32 56.31,21.16 | T161.3 v58.06,35.81 T162.3 | v63.5,67.31 65.37,69.18 LED6.A | v74.3,26.67 75.83,25.13 LED14.A
  Bottom 0.152: v21.59,71.75 20.95,71.75 10.16,60.96 10.16,55.88 6.99,52.7 6.99,37.94 6.76,37.72 6.76,37.21 6.99,36.99 v6.99,33.02 6.99,27.15 7.46,26.67 7.46,25.8 10.55,22.71 10.55,22.47 16.87,16.15 16.89,16.15 17.42,15.62 17.42,15.6 26.67,6.35 31.4,6.35 31.63,6.12 32.13,6.12 32.35,6.35 v36.83,6.35 47.99,6.35 48.01,6.37 48.77,6.37 48.79,6.35 53.98,6.35 v62.87,15.24 66.4,18.77 66.42,18.77 66.95,19.31 66.95,19.33 69.88,22.25 70.1,22.25 74.3,26.45 v74.3,26.67 74.3,37.32 74.27,37.34 74.27,38.1 74.3,38.12 74.3,43.18 74.55,43.43 74.55,56.9 68.55,62.89 68.55,63.12 68.2,63.47 67.97,63.47 64.14,67.31 v63.5,67.31 | v60.33,16.51 57.15,19.68 v57.15,20.32 | v56.24,30.48 56.24,33.98 v58.06,35.81
OUT7  (via drill 0.35)  (4 unrouted)
  Top 0.152: 56.24,46.35 T173.3 56.24,40.08 56.49,39.83 56.49,39.21 56.81,38.89 56.81,37.81 56.67,37.68 56.33,37.68 T170.1 T169.1 53.86,39.03 53.77,39.03 53.63,38.89 53.63,38.45 52.86,37.68 52.51,37.68 T172.1 | 56.24,46.35 T174.3 | NOR2:T4.3 44.23,58.04 44.9,57.37 45.88,57.37 46.01,57.5 46.01,57.78 | NOR2:T1.3 46.01,63.31 46.01,57.78 | 46.01,57.78 46.65,57.15 v46.99,57.15 | T49.3 57.15,53.31 v57.15,52.7 58.06,51.79 T50.3 | LED39.A 27.05,74.67 v26.67,74.3 | v7.37,37.47 3.46,37.47 LED31.A | v31.88,6.73 31.88,4.88 LED23.A | LED15.A 72.9,19.81 v69.85,22.86 | v73.79,49.53 63.5,49.53 v62.87,48.9 | v57.15,46.99 56.87,46.99 56.24,46.35 | v67.94,62.87 69.83,64.75 LED7.A
  Bottom 0.152: v46.99,57.15 51.44,52.7 v57.15,52.7 v57.15,46.99 59.05,48.9 v62.87,48.9 | v26.67,74.3 25.4,74.3 10.54,59.44 10.54,55.75 7.37,52.58 v7.37,37.47 7.37,33.5 7.59,33.27 7.59,32.77 7.37,32.54 7.37,27.3 7.87,26.8 7.87,25.82 10.85,22.84 10.85,22.8 26.92,6.73 v31.88,6.73 32.3,6.73 32.35,6.68 36.3,6.68 36.58,6.96 37.08,6.96 37.36,6.68 53.45,6.68 62.61,15.85 62.84,15.85 62.87,15.88 63.07,15.88 66.27,19.08 66.29,19.08 66.65,19.43 66.65,19.45 69.85,22.66 v69.85,22.86 73.69,26.7 73.69,26.92 73.99,27.22 73.99,37.19 73.97,37.22 73.97,43.28 74.24,43.56 74.24,48.82 73.79,49.28 v73.79,49.53 73.79,57.02 v67.94,62.87
OUT8  (via drill 0.35)  (4 unrouted)
  Top 0.152: T62.3 T61.3 v56.24,57.78 56.24,55.95 56.49,55.7 56.49,55.09 56.81,54.77 56.81,53.69 56.67,53.56 56.33,53.56 T58.1 T57.1 53.86,54.9 53.77,54.9 53.63,54.77 53.63,54.33 52.86,53.56 52.51,53.56 T60.1 | v70.48,58.42 71.79,59.73 LED8.A | v66.04,19.68 69.18,16.55 LED16.A | v26.67,8.26 26.67,7.44 LED24.A | v8.26,43.18 4,43.18 LED32.A
  Bottom 0.152: v56.24,57.78 56.87,58.42 v70.48,58.42 73.03,55.88 73.03,49.4 73.66,48.77 73.66,27.32 73.38,27.05 73.38,27.03 69.82,23.47 69.6,23.47 69.24,23.11 69.24,22.89 v66.04,19.68 62.51,16.15 62.49,16.15 53.32,6.99 37.48,6.99 37.21,7.26 36.45,7.26 36.18,6.99 32.48,6.99 32.13,7.34 31.63,7.34 31.51,7.22 27.7,7.22 v26.67,8.26 8.26,26.67 v8.26,43.18

### Text on the board
tPlace: CMOS LED chaser | Ondřej Mach 2019